# EasyEDA Pro project 20240709.epro

# Schematic B1

## Sheets
1 ETH: Board Name: Project; Create Date: 2024-09-07; Page Name: ETH; Project Name: 20240907; Schematic Name: B1; Update Date: 2024-09-07
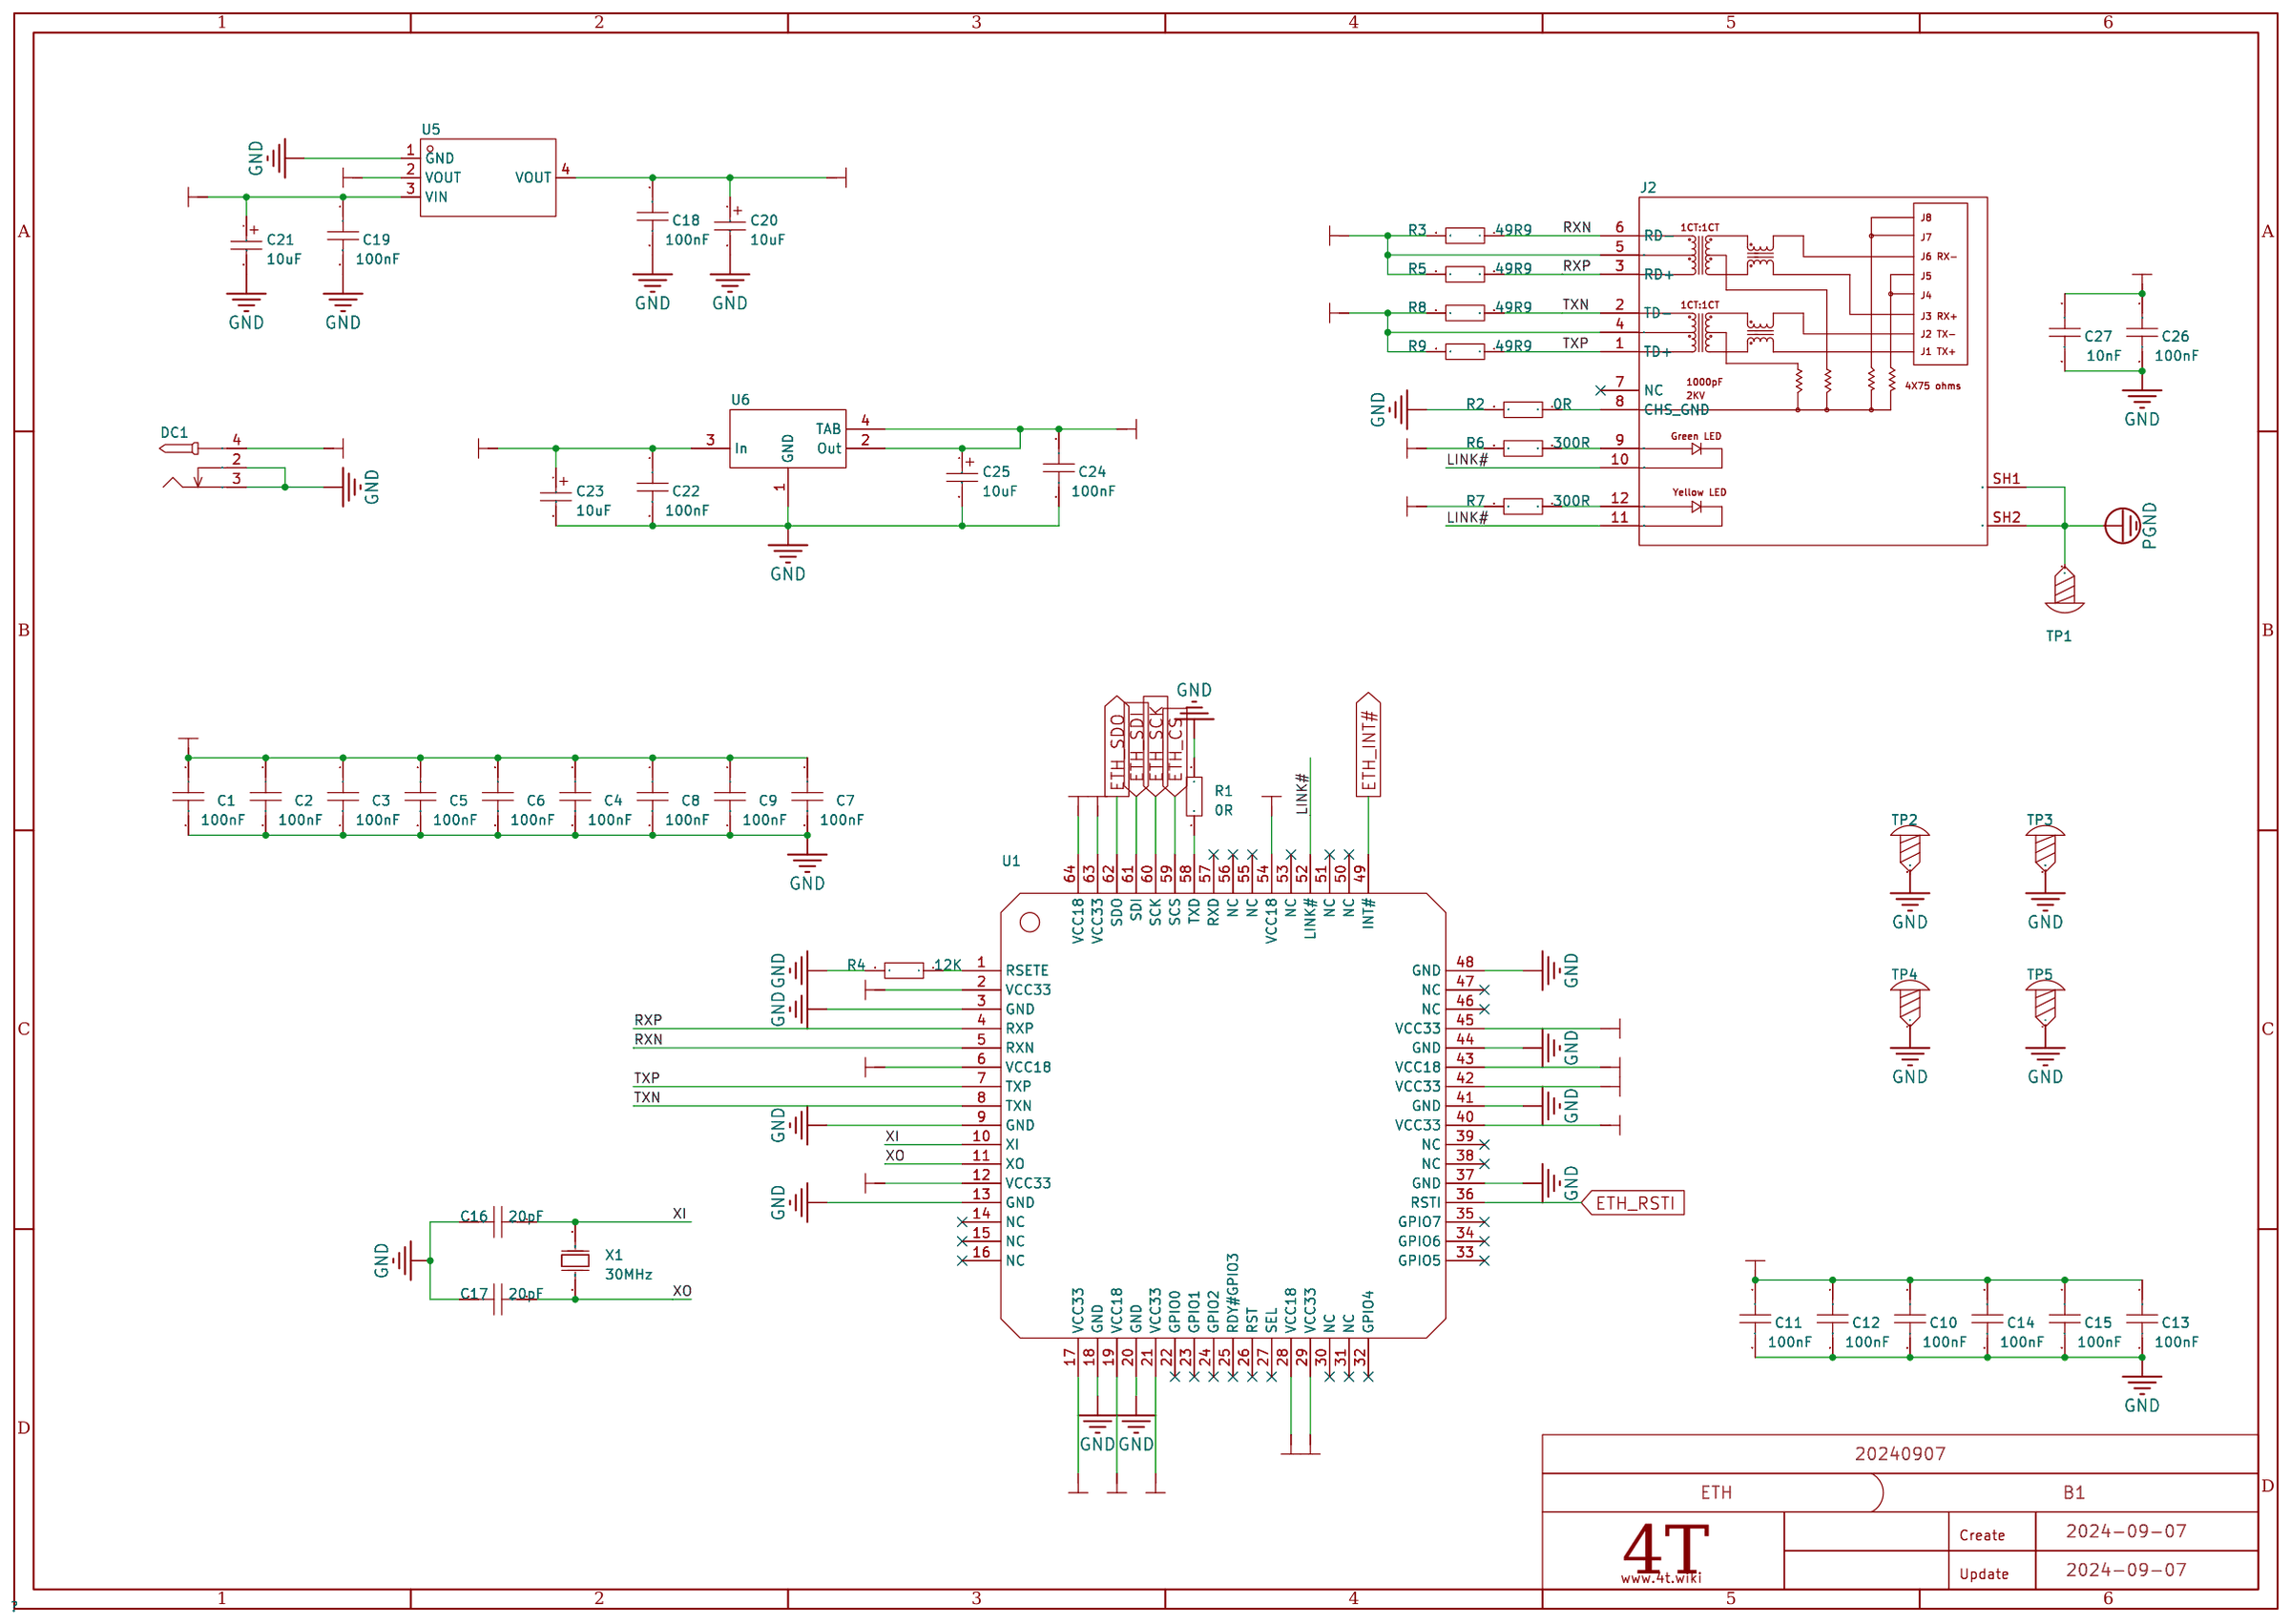
[diagram p0: ETH]
2 MP: Page Name: MP
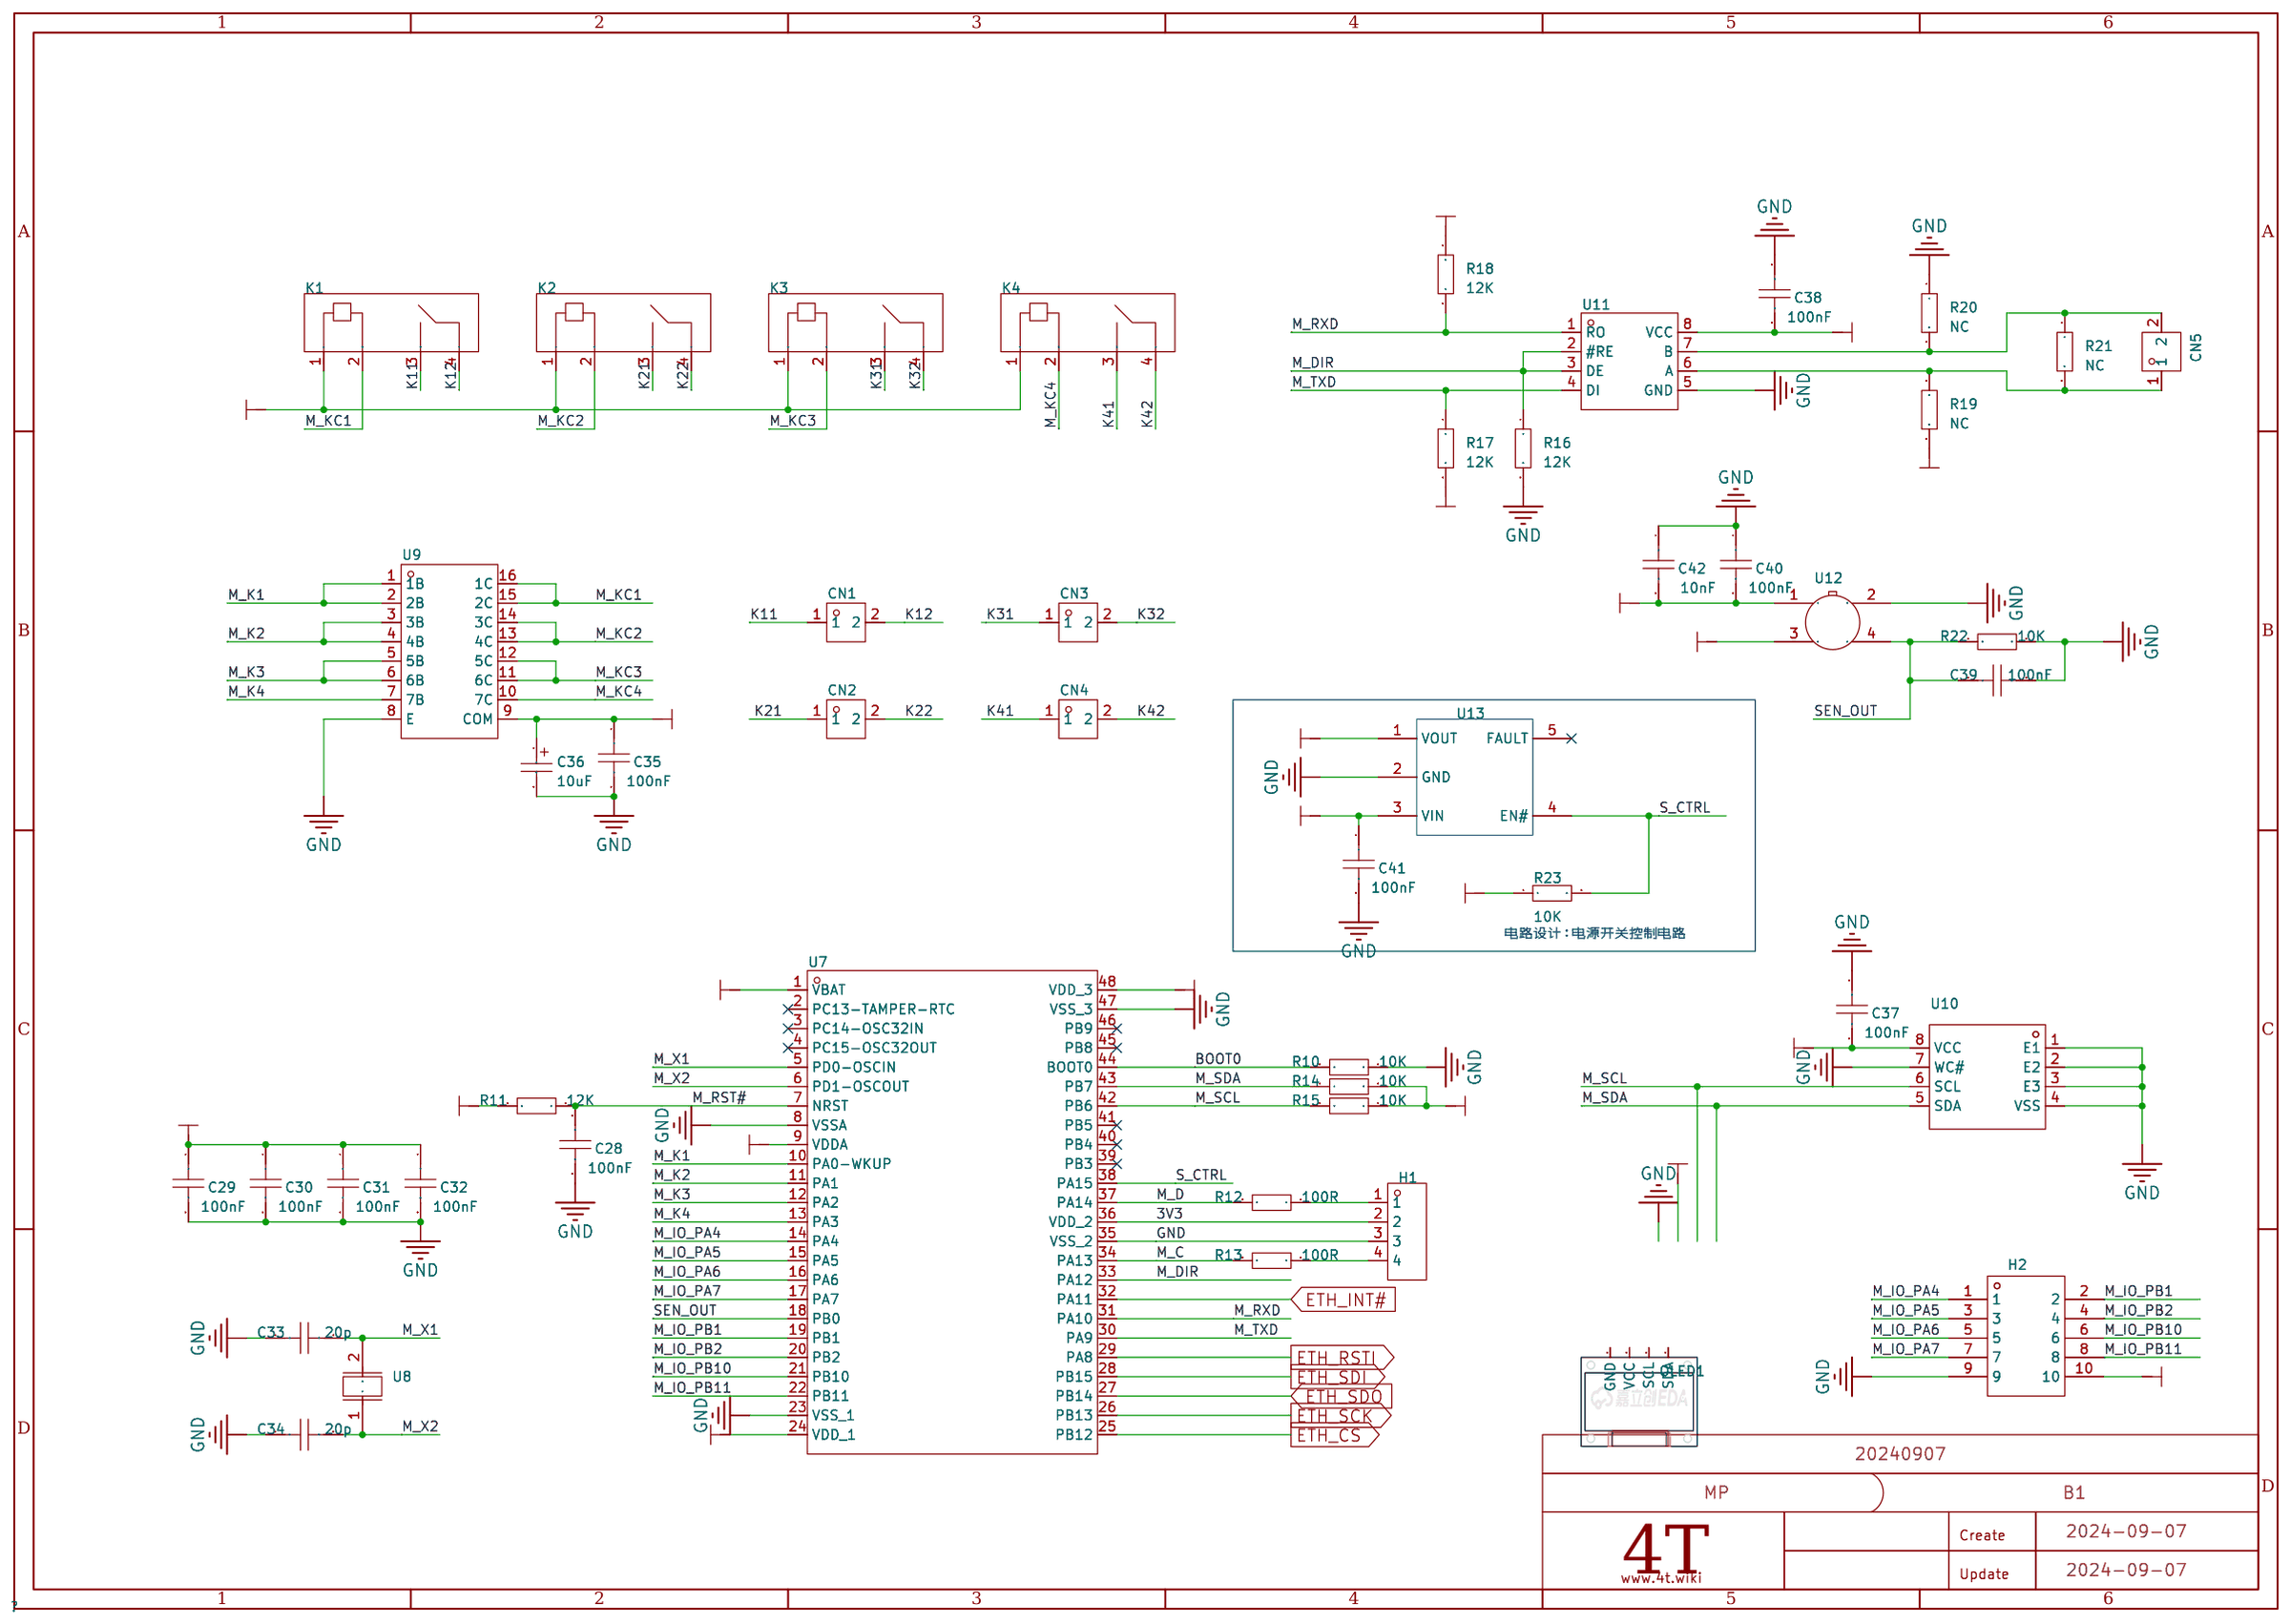
[diagram p1: MP]

## Parts
sheet ETH
C1  100nF  [C0805]
C2  100nF  [C0805]
C3  100nF  [C0805]
C4  100nF  [C0805]
C5  100nF  [C0805]
C6  100nF  [C0805]
C7  100nF  [C0805]
C8  100nF  [C0805]
C9  100nF  [C0805]
C10  100nF  [C0805]
C11  100nF  [C0805]
C12  100nF  [C0805]
C13  100nF  [C0805]
C14  100nF  [C0805]
C15  100nF  [C0805]
C16  20pF  [C0805]
C17  20pF  [C0805]
C18  100nF  [C0805]
C19  100nF  [C0805]
C20  10uF  [C_Ele_SMD_3x5.4mm]
C21  10uF  [C_Ele_SMD_3x5.4mm]
C22  100nF  [C0805]
C23  10uF  [C_Ele_SMD_3x5.4mm]
C24  100nF  [C0805]
C25  10uF  [C_Ele_SMD_3x5.4mm]
C26  100nF  [C0805]
C27  10nF  [C0805]
DC1  -  [DC-2.0]
J2  HY911105AE  [RJ45-TH_HR911105A]
R1  0R  [R0805]
R2  0R  [R0805]
R3  49R9  [R0805]
R4  12K  [R0805]
R5  49R9  [R0805]
R6  300R  [R0805]
R7  300R  [R0805]
R8  49R9  [R0805]
R9  49R9  [R0805]
TP1  -  [M3螺丝]
TP2  -  [M2螺丝]
TP3  -  [M2螺丝]
TP4  -  [M2螺丝]
TP5  -  [M2螺丝]
U1  CH395Q  [LQFP-64_L10.0-W10.0-P0.50-LS12.0-BL]
U5  AMS1117-3.3  [SOT-223-3_L6.5-W3.4-P2.30-LS7.0-BR]
U6  AMS1117-1.8  [SOT-223-4_L6.5-W3.5-P2.30-LS7.0-BR]
X1  30MHz  [OSC-SMD_L5.0-W3.2]
sheet MP
C28  100nF  [C0805]
C29  100nF  [C0805]
C30  100nF  [C0805]
C31  100nF  [C0805]
C32  100nF  [C0805]
C33  20p  [C0805]
C34  20p  [C0805]
C35  100nF  [C0805]
C36  10uF  [C_Ele_SMD_3x5.4mm]
C37  100nF  [C0805]
C38  100nF  [C0805]
C39  100nF  [C0805]
C40  100nF  [C0805]
C41  100nF  [C0805]
C42  10nF  [C0805]
CN1  KF128L-5.08-2P 蓝色  [TH_KF128L-5.08-2P]
CN2  KF128L-5.08-2P 蓝色  [TH_KF128L-5.08-2P]
CN3  KF128L-5.08-2P 蓝色  [TH_KF128L-5.08-2P]
CN4  KF128L-5.08-2P 蓝色  [TH_KF128L-5.08-2P]
CN5  KF128L-5.08-2P 蓝色  [TH_KF128L-5.08-2P]
H1  -  [HDR-TH_4P-P2.54-V-F]
H2  -  [HDR-TH_10P-P2.54-V-M-R2-C5-S2.54]
K1  HF49FD/012-1H12  [RELAY-TH_HF49FD-XXX-1H12-XXX]
K2  HF49FD/012-1H12  [RELAY-TH_HF49FD-XXX-1H12-XXX]
K3  HF49FD/012-1H12  [RELAY-TH_HF49FD-XXX-1H12-XXX]
K4  HF49FD/012-1H12  [RELAY-TH_HF49FD-XXX-1H12-XXX]
OLED1  -  [0.96OLED_4P]
R10  10K  [R0805]
R11  12K  [R0805]
R12  100R  [R0805]
R13  100R  [R0805]
R14  10K  [R0805]
R15  10K  [R0805]
R16  12K  [R0805]
R17  12K  [R0805]
R18  12K  [R0805]
R19  NC  [R0805]
R20  NC  [R0805]
R21  NC  [R0805]
R22  10K  [R0805]
R23  10K  [R0805]
U7  GD32F303CBT6  [LQFP-48_L7.0-W7.0-P0.50-LS9.0-BL]
U8  8M-5032-2P  [CRYSTAL-SMD_L5.0-W3.2]
U9  ULN2003  [SOIC-16_L9.9-W3.9-P1.27-LS6.0-BL]
U10  M24C02-WMN6TP  [SOIC-8_L4.9-W3.9-P1.27-LS6.0-BL]
U11  MAX3485ESA  [SOP-8_L5.0-W4.0-P1.27-LS6.0-BL]
U12  MP-2  [SENSOR-TH_MP-5]
U13  -  [SOT_PDS]

## Library data of the parts
C1-C19 C22 C24 C26-C35 C37-C42 = CAP_0603: Supplier Footprint: 0603
C20 C21 C23 C25 C36 = C_Ele_SMD_3x5.4mm: Supplier Footprint: SMD,3x5.4mm
DC1 = DC-005_2.0: Supplier Footprint: 插件
J2 = HY911105AE: 连接器类型:RJ插座;USOC代码:RJ45;端口数量:1;等级:-;屏蔽:-;LED:-;; LCSC Part Name: RJ45 带变压器; Supplier Part: C69427; Manufacturer: HANRUN(汉仁); Supplier Footprint: 插件; JLCPCB Part Class: 扩展库; Datasheet: https://atta.szlcsc.com/upload/public/pdf/source/20160507/1462613611469.pdf; Supplier: LCSC; Connector Type: RJ插座; USOC Codes: RJ45; Number of Ports: 1
R1-R23 = Res_0805: Supplier Footprint: 0805
TP1 = M3螺丝: Supplier Footprint: 插件
TP2-TP5 = M2螺丝: Supplier Footprint: 插件
U1 = CH395Q: 应用功能:以太网控制器;通道数:-;接口类型:Parallel, SPI, UART;电源电压:1.65V~3.6V;电源电流:90mA;; Supplier Part: C87390; Manufacturer: WCH(南京沁恒); Supplier Footprint: LQFP-64(10x10); JLCPCB Part Class: 扩展库; Datasheet: https://atta.szlcsc.com/upload/public/pdf/source/20200903/C87390_2BA27438C515B4B897A780BE99160E01.pdf; Supplier: LCSC; Application Function: 以太网控制器; Interface: Parallel, SPI, UART; Supply Voltage: 1.65V~3.6V; Supply Current: 90mA
U5 = AMS1117-3.3_C6186: 输出类型:固定;输出极性:正;输出通道数:1;最大输入电压:-;输出电压:3.3V;压差:1.3V@(800mA);静态电流(地电流):-;输出电流:1A;电源纹波抑制比(PSRR):72dB@(120Hz);噪声:-;特性:-;工作温度:-;; LCSC Part Name: 正 Vout=3.3V 1A 72dB@(120Hz); Supplier Part: C6186; Manufacturer: AMS; Supplier Footprint: SOT-223-3; JLCPCB Part Class: 基础库; Datasheet: https://atta.szlcsc.com/upload/public/pdf/source/20180727/C6186_7A095716F0823C02F1997A905E26C086.pdf; Supplier: LCSC; Output Type: 固定; Output Polarity: 正; Number of Outputs: 1; Output Voltage: 3.3V; Dropout Voltage: 1.3V@(800mA); Output Current: 1A; Power Supply Rejection Ratio (PSRR): 72dB@(120Hz)
U6 = AMS1117-1.8_C6185: 输出类型:固定;输出极性:正;输出通道数:1;最大输入电压:15V;输出电压:1.8V~1.8V;压差:1.3V@(1A);输出电流:1A;电源纹波抑制比(PSRR):75dB@(120Hz);; LCSC Part Name: 正 Vin=15V Vout=1.8V~1.8V 1A 75dB@(120Hz); Supplier Part: C6185; Manufacturer: AMS; Supplier Footprint: SOT-223-4; JLCPCB Part Class: 扩展库; Datasheet: https://atta.szlcsc.com/upload/public/pdf/source/20180727/C6186_7A095716F0823C02F1997A905E26C086.pdf; Supplier: LCSC; Output Type: 固定; Output Polarity: 正; Number of Outputs: 1; Maximum Input Voltage: 15V; Output Voltage: 1.8V~1.8V; Dropout Voltage: 1.3V@(1A); Output Current: 1A; Power Supply Rejection Ratio (PSRR): 75dB@(120Hz)
X1 = X503230MSB2GI: 晶振类型:贴片无源晶振;频率:30MHz;频率公差:±10ppm;频率稳定度:±50ppm;负载电容:20pF;工作温度:-40℃~+85℃;; LCSC Part Name: YSX530GA 30MHz ±10ppm 20pF; Supplier Part: C112563; Manufacturer: YXC(扬兴晶振); Supplier Footprint: SMD5032-2P; JLCPCB Part Class: 扩展库; Datasheet: https://atta.szlcsc.com/upload/public/pdf/source/20210329/C112559_847D3CACBA33ACCEB57DEA3AEBB187A1.pdf; Supplier: LCSC; Crystal Type: 贴片无源晶振; Frequency Tolerance: ±10ppm; Frequency Stability: ±50ppm; Load Capacitance: 20pF; Operating Temperature: -40℃~+85℃
CN1-CN5 = KF128L-5.08-2P 蓝色: Supplier Part: C2916931; Supplier Footprint: 5.08-2P; JLCPCB Part Class: 扩展库; Supplier: LCSC
H1 = HDR-F_2.54_1x4P: Supplier Part: C2718488; Supplier Footprint: 插件
H2 = HDR-M_2.54_2x5: Supplier Part: C124387; Supplier Footprint: 插件,P=2.54mm
K1-K4 = HF49FD/012-1H12: 线圈电压:12V;线圈类型:非极化-单线圈;触点形式:一组常开:1A(单刀单掷-常开);最大切换电流:5A;触点材料:AgNi;; LCSC Part Name: 宏发继电器; Supplier Part: C399491; Manufacturer: HF(宏发); Supplier Footprint: SIP-4; JLCPCB Part Class: 扩展库; Datasheet: https://atta.szlcsc.com/upload/public/pdf/source/20190620/C399491_B2190B02DDD565265172868420E7880D.pdf; Supplier: LCSC; Coil Voltage: 12V; Coil Type: 非极化-单线圈; Pin Number: 4; Contact Form: 一组常开:1A(单刀单掷-常开); Maximum Switching Current: 5A; Maximum Switching Voltage: 250V@AC；30V@DC; Coil Rated Power: 120mW; Contact Rating: 5A@30VDC；5A@250VAC; Coil Resistance: 1.2kΩ; Operate Time: 10ms; Release Time: 5ms; Contact Resistance: 100mΩ; Contact Material: AgNi; Operating Temperature: -40℃~+85℃
OLED1 = 0.96OLED模块_4P: Supplier Footprint: 插件
U7 = GD32F303CBT6_C3013779: CPU内核:ARM Cortex-M4;CPU最大主频:120MHz;工作电压范围:-;程序存储容量:128KB;RAM总容量:32KB;EEPROM/数据 FLASH容量:128KB;GPIO端口数量:37;ADC(位数):12bit;DAC(位数):12bit;(E)PWM(位数):-;8位Timer数量:-;16位Timer数量:7;32位Timer数量:-;CAN路数:1;U(S)ART路数:3;I2C路数:2;I2S路数:2;(Q)SPI路数:3;外设/功能:看门狗；RTC实时时钟;内部振荡器:; LCSC Part Name: ARM Cortex-M4 120MHz; Supplier Part: C3013779; Manufacturer: GigaDevice(兆易创新); Supplier Footprint: LQFP-48(7x7); JLCPCB Part Class: 扩展库; Datasheet: https://atta.szlcsc.com/upload/public/pdf/source/20220624/E1A57ED816B162D6D1424864911A792F.pdf; Supplier: LCSC; CPU Core: ARM Cortex-M4; CPU Maximum Speed: 120MHz; Program Storage Size: 128KB; Program Memory Type: FLASH; RAM Size: 32KB; EEPROM: 128KB; GPIO Ports Number: 37; ADC (Bit): 12bit; DAC (Bit): 12bit; 16Bit Timer: 7; CAN: 1; UART/USART: 3; I2C: 2; I2S: 2; SPI: 3; Peripheral/Function: 看门狗；RTC实时时钟; Watchdog: 有; Real-Time Clock: 有
U8 = 8M-5032-2P: Supplier Part: C9900017580; Supplier Footprint: 8MHz; JLCPCB Part Class: 扩展库; Supplier: LCSC
U9 = ULN2003: 开态输入电压(VI(on)@Vce,Ic):3V@2V,300mA;集射极饱和压降(VCE(sat)@Ii,Ic):1.2V@500uA,350mA;输出漏电流(Icex@Vce):50uA@50V;开态输入电流(Ii@Vi):-;关态输入电流(Ii(off)@Vce,Ic):65uA@50V,500uA;嵌位二极管漏电流(IR@VR):50uA@50V;嵌位二极管正向压降(VF@IF):1.7V@350mA;输入电容(Ci):15pF;工作温度:-20℃~+85℃;; Supplier Part: C688859; Manufacturer: IDCHIP(英锐芯); Supplier Footprint: SOIC-16; JLCPCB Part Class: 扩展库; Datasheet: https://atta.szlcsc.com/upload/public/pdf/source/20210302/C688859_5C67C6CBB0EA78EF92AFC966B53E1AD0.pdf; Supplier: LCSC; ON-state input   voltage(VI(on)@Vce,Ic): 3V@2V,300mA; Collector-emitter   saturation voltage (VCE(sat)@Ii,Ic): 1.2V@500uA,350mA; Output leakage current (Icex@Vce): 50uA@50V; Off-state input current (Ii(off)@Vce,Ic): 65uA@50V,500uA; Clamp Diode Leakage Current (IR@VR): 50uA@50V; Clamp Diode Forward Voltage (VF@IF): 1.7V@350mA; Input Capacitance (Ci): 15pF; Operating Temperature: -20℃~+85℃
U10 = M24C02-WMN6TP: 2-Kbit(256 x 8bit)，I2C接口，工作电压：2.5V to 5.5V; Supplier Part: C7562; Manufacturer: ST(意法半导体); Supplier Footprint: SOIC-8; JLCPCB Part Class: 基础库; Datasheet: https://atta.szlcsc.com/upload/public/pdf/source/20140724/1457707167301.pdf; Supplier: LCSC
U11 = MAX3485ESA: Supplier Part: C668204; Manufacturer: UMW(广东友台半导体); Supplier Footprint: SOP-8; JLCPCB Part Class: 扩展库; Datasheet: https://atta.szlcsc.com/upload/public/pdf/source/20221009/BC018EFD0F414E24649E284F574E449C.pdf; Supplier: LCSC
U12 = MP-2: Supplier Part: C242497; Manufacturer: Winsen(炜盛); Supplier Footprint: 插件; JLCPCB Part Class: 扩展库; Datasheet: https://atta.szlcsc.com/upload/public/pdf/source/20180704/C242497_B8D2418C2743DA3210851F2FB82DA8BD.pdf; Supplier: LCSC
U13 = PDS

## Nets
1V8: C10.1 C11.1 C12.1 C13.1 C14.1 C15.1 C24.1 C25.1 U1.6(VCC18) U1.19(VCC18) U1.28(VCC18) U1.43(VCC18) U1.54(VCC18) U1.63(VCC33) U6.2(Out) U6.4(TAB)
3V3: C1.1 C2.1 C3.1 C4.1 C5.1 C6.1 C7.1 C8.1 C9.1 C18.1 C20.1 C22.1 C23.1 C26.1 C27.1 C29.1 C30.1 C31.1 C32.1 C37.2 C38.2 H1.2 H2.10 J2.4 J2.5 R3.2 R5.2 R6.2 R7.2 R8.2 R9.2 R11.2 R14.2 R15.1 R17.2 R18.1 R19.2 R23.1 U1.2(VCC33) U1.12(VCC33) U1.17(VCC33) U1.21(VCC33) U1.29(VCC33) U1.40(VCC33) U1.42(VCC33) U1.45(VCC33) U1.64(VCC18) U5.2(VOUT) U5.4(VOUT) U6.3(In) U7.1(VBAT) U7.9(VDDA) U7.24(VDD_1) U7.36(VDD_2) U7.48(VDD_3) U10.8(VCC) U11.8(VCC) U12.3
GND: C1.2 C2.2 C3.2 C4.2 C5.2 C6.2 C7.2 C8.2 C9.2 C10.2 C11.2 C12.2 C13.2 C14.2 C15.2 C16.1 C17.1 C18.2 C19.2 C20.2 C21.2 C22.2 C23.2 C24.2 C25.2 C26.2 C27.2 C28.2 C29.2 C30.2 C31.2 C32.2 C33.1 C34.1 C35.2 C36.2 C37.1 C38.1 C39.2 C40.1 C41.2 C42.1 DC1.2 DC1.3 H1.3 H2.9 R1.2 R2.2 R4.2 R10.1 R16.2 R20.1 R22.2 TP2.1 TP3.1 TP4.1 TP5.1 U1.3(GND) U1.9(GND) U1.13(GND) U1.18(GND) U1.20(GND) U1.37(GND) U1.41(GND) U1.44(GND) U1.48(GND) U5.1(GND) U6.1(GND) U7.8(VSSA) U7.23(VSS_1) U7.35(VSS_2) U7.47(VSS_3) U9.8(E) U10.1(E1) U10.2(E2) U10.3(E3) U10.4(VSS) U10.7(WC#) U11.5(GND) U12.2 U13.2(GND)
PGND: J2.SH1 J2.SH2 TP1.1
BOOT0: R10.2 U7.44(BOOT0)
DC: C19.1 C21.1 C35.1 C36.1 C41.1 DC1.4 K1.1 K2.1 K3.1 K4.1 U5.3(VIN) U9.9(COM) U13.3(VIN)
ETH_CS: U1.59(SCS) U7.25(PB12)
ETH_INT#: U1.49(INT#) U7.32(PA11)
ETH_RSTI: U1.36(RSTI) U7.29(PA8)
ETH_SCK: U1.60(SCK) U7.26(PB13)
ETH_SDI: U1.61(SDI) U7.28(PB15)
ETH_SDO: U1.62(SDO) U7.27(PB14)
K11: CN1.1 K1.3
K12: CN1.2 K1.4
K21: CN2.1 K2.3
K22: CN2.2 K2.4
K31: CN3.1 K3.3
K32: CN3.2 K3.4
K41: CN4.1 K4.3
K42: CN4.2 K4.4
LINK#: J2.10 J2.11 U1.52(LINK#)
M_C: R13.2 U7.34(PA13)
M_D: R12.2 U7.37(PA14)
M_DIR: R16.1 U7.33(PA12) U11.2(#RE) U11.3(DE)
M_IO_PA4: H2.1 U7.14(PA4)
M_IO_PA5: H2.3 U7.15(PA5)
M_IO_PA6: H2.5 U7.16(PA6)
M_IO_PA7: H2.7 U7.17(PA7)
M_IO_PB1: H2.2 U7.19(PB1)
M_IO_PB2: H2.4 U7.20(PB2)
M_IO_PB10: H2.6 U7.21(PB10)
M_IO_PB11: H2.8 U7.22(PB11)
M_K1: U7.10(PA0-WKUP) U9.1(1B) U9.2(2B)
M_K2: U7.11(PA1) U9.3(3B) U9.4(4B)
M_K3: U7.12(PA2) U9.5(5B) U9.6(6B)
M_K4: U7.13(PA3) U9.7(7B)
M_KC1: K1.2 U9.15(2C) U9.16(1C)
M_KC2: K2.2 U9.13(4C) U9.14(3C)
M_KC3: K3.2 U9.11(6C) U9.12(5C)
M_KC4: K4.2 U9.10(7C)
M_RST#: C28.1 R11.1 U7.7(NRST)
M_RXD: R18.2 U7.31(PA10) U11.1(RO)
M_SCL: R15.2 U7.42(PB6) U10.6(SCL)
M_SDA: R14.1 U7.43(PB7) U10.5(SDA)
M_TXD: R17.1 U7.30(PA9) U11.4(DI)
M_X1: C33.2 U7.5(PD0-OSCIN) U8.2
M_X2: C34.2 U7.6(PD1-OSCOUT) U8.1
RXN: J2.6(RD-) R3.1 U1.5(RXN)
RXP: J2.3(RD+) R5.1 U1.4(RXP)
S_CTRL: R23.2 U7.38(PA15) U13.4(EN#)
SEN_OUT: C39.1 R22.1 U7.18(PB0) U12.4
TXN: J2.2(TD-) R8.1 U1.8(TXN)
TXP: J2.1(TD+) R9.1 U1.7(TXP)
V_HU: C40.2 C42.2 U12.1 U13.1(VOUT)
XI: C16.2 U1.10(XI) X1.2(OSC2)
XO: C17.2 U1.11(XO) X1.1(OSC1)
$1N6890: R4.1 U1.1(RSETE)
$1N7627: R1.1 U1.58(TXD)
$1N10654: J2.8(CHS GND) R2.1
$1N10919: J2.12 R7.1
$1N10952: J2.9 R6.1
$2N5291: H1.1 R12.1
$2N5344: H1.4 R13.1
$2N14954: CN5.2 R20.2 R21.1 U11.7(B)
$2N14989: CN5.1 R19.1 R21.2 U11.6(A)

Not connected (* = marked no-connect by the designer): J2 7(NC)*; OLED1 1(GND) 2(VCC) 3(SCL) 4(SDA); U1 14(NC)* 15(NC)* 16(NC)* 22(GPIO0)* 23(GPIO1)* 24(GPIO2)* 25(RDY#GPIO3)* 26(RST)* 27(SEL)* 30(NC)* 31(NC)* 32(GPIO4)* 33(GPIO5)* 34(GPIO6)* 35(GPIO7)* 38(NC)* 39(NC)* 46(NC)* 47(NC)* 50(NC)* 51(NC)* 53(NC)* 55(NC)* 56(NC)* 57(RXD)*; U7 2(PC13-TAMPER-RTC)* 3(PC14-OSC32IN)* 4(PC15-OSC32OUT)* 39(PB3)* 40(PB4)* 41(PB5)* 45(PB8)* 46(PB9)*; U13 5(FAULT)*

## Notes on the sheets
sheet 2
- 电路设计：电源开关控制电路

# Board B1
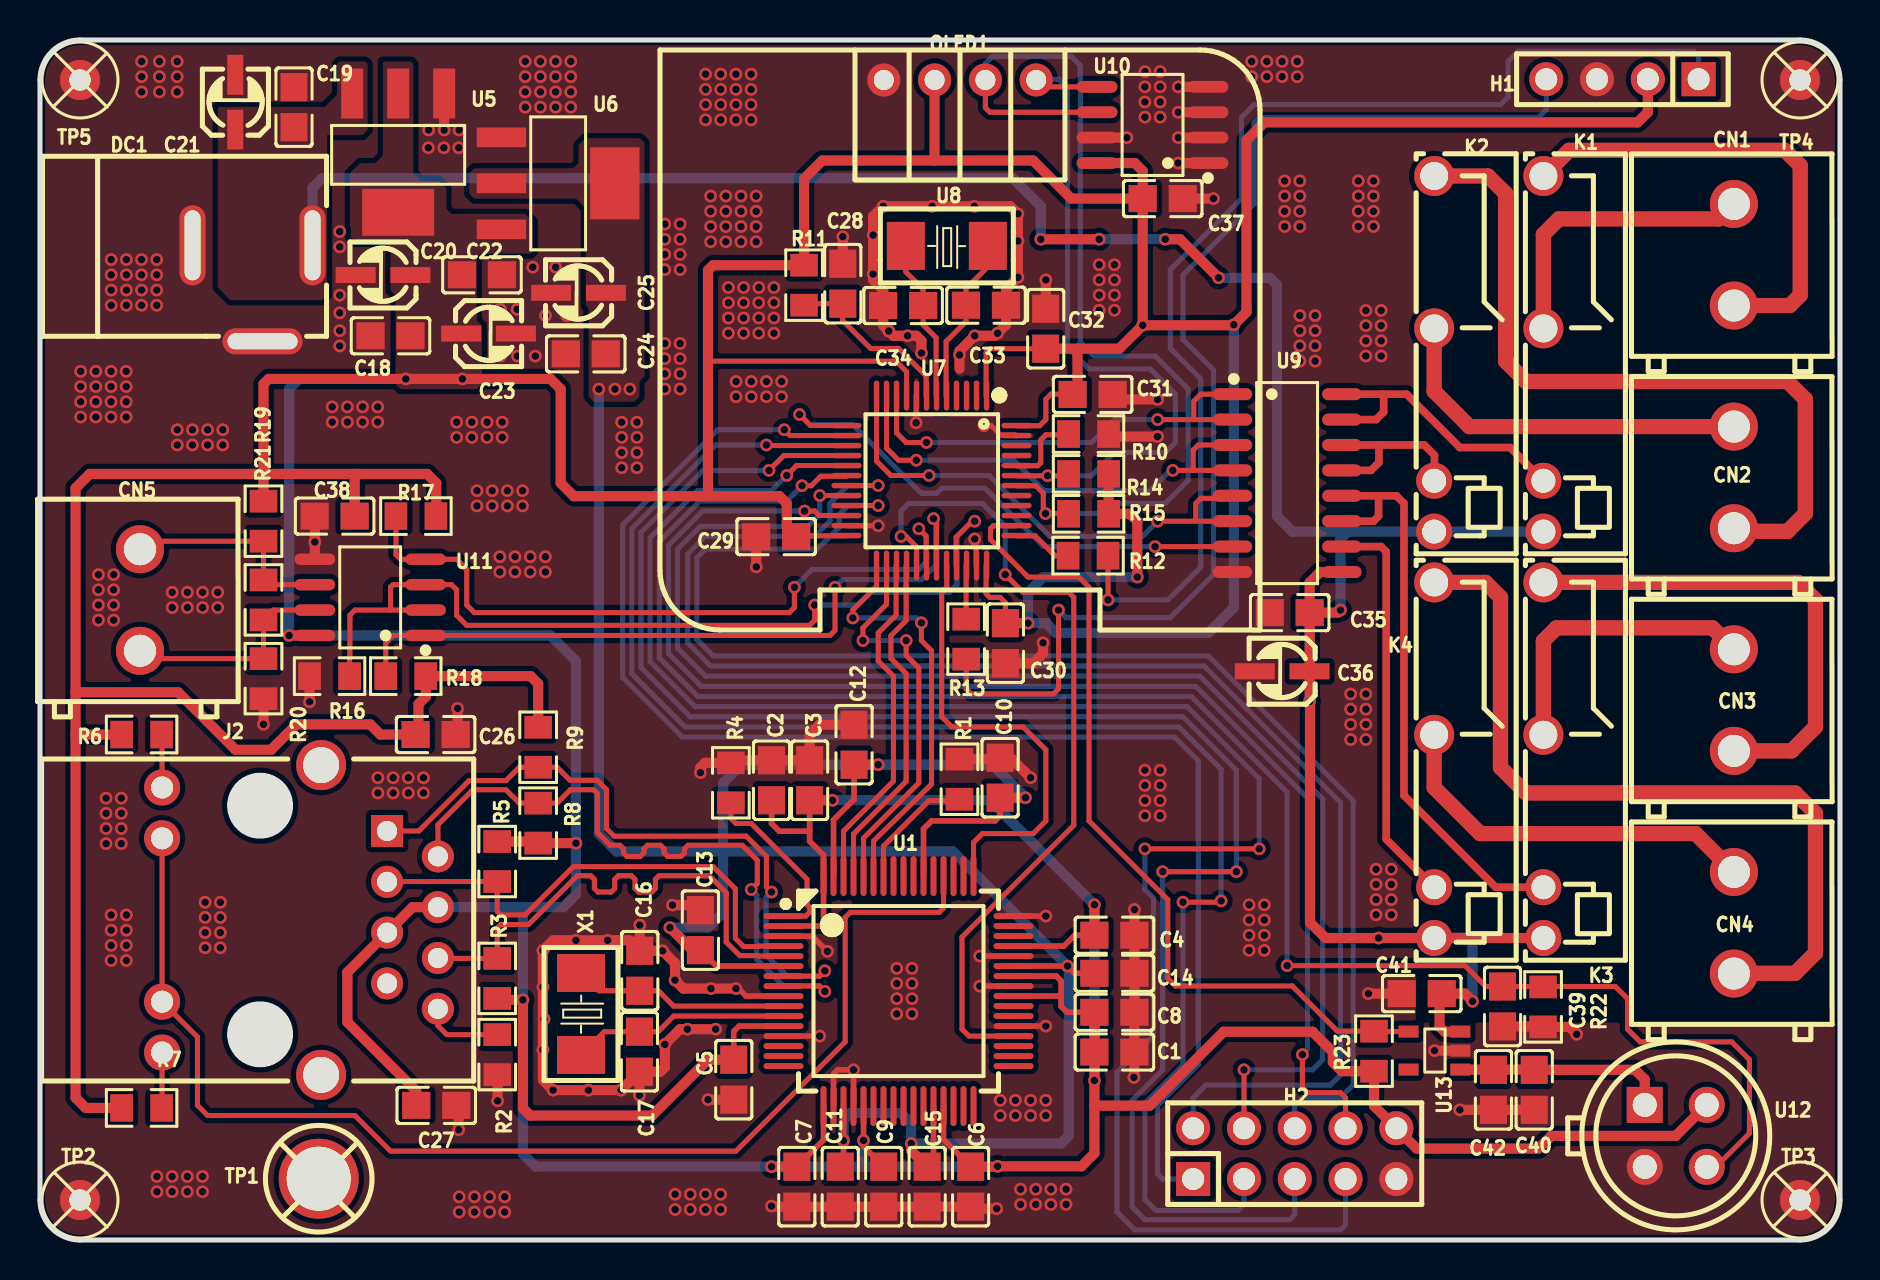
[diagram p2: board, top side]
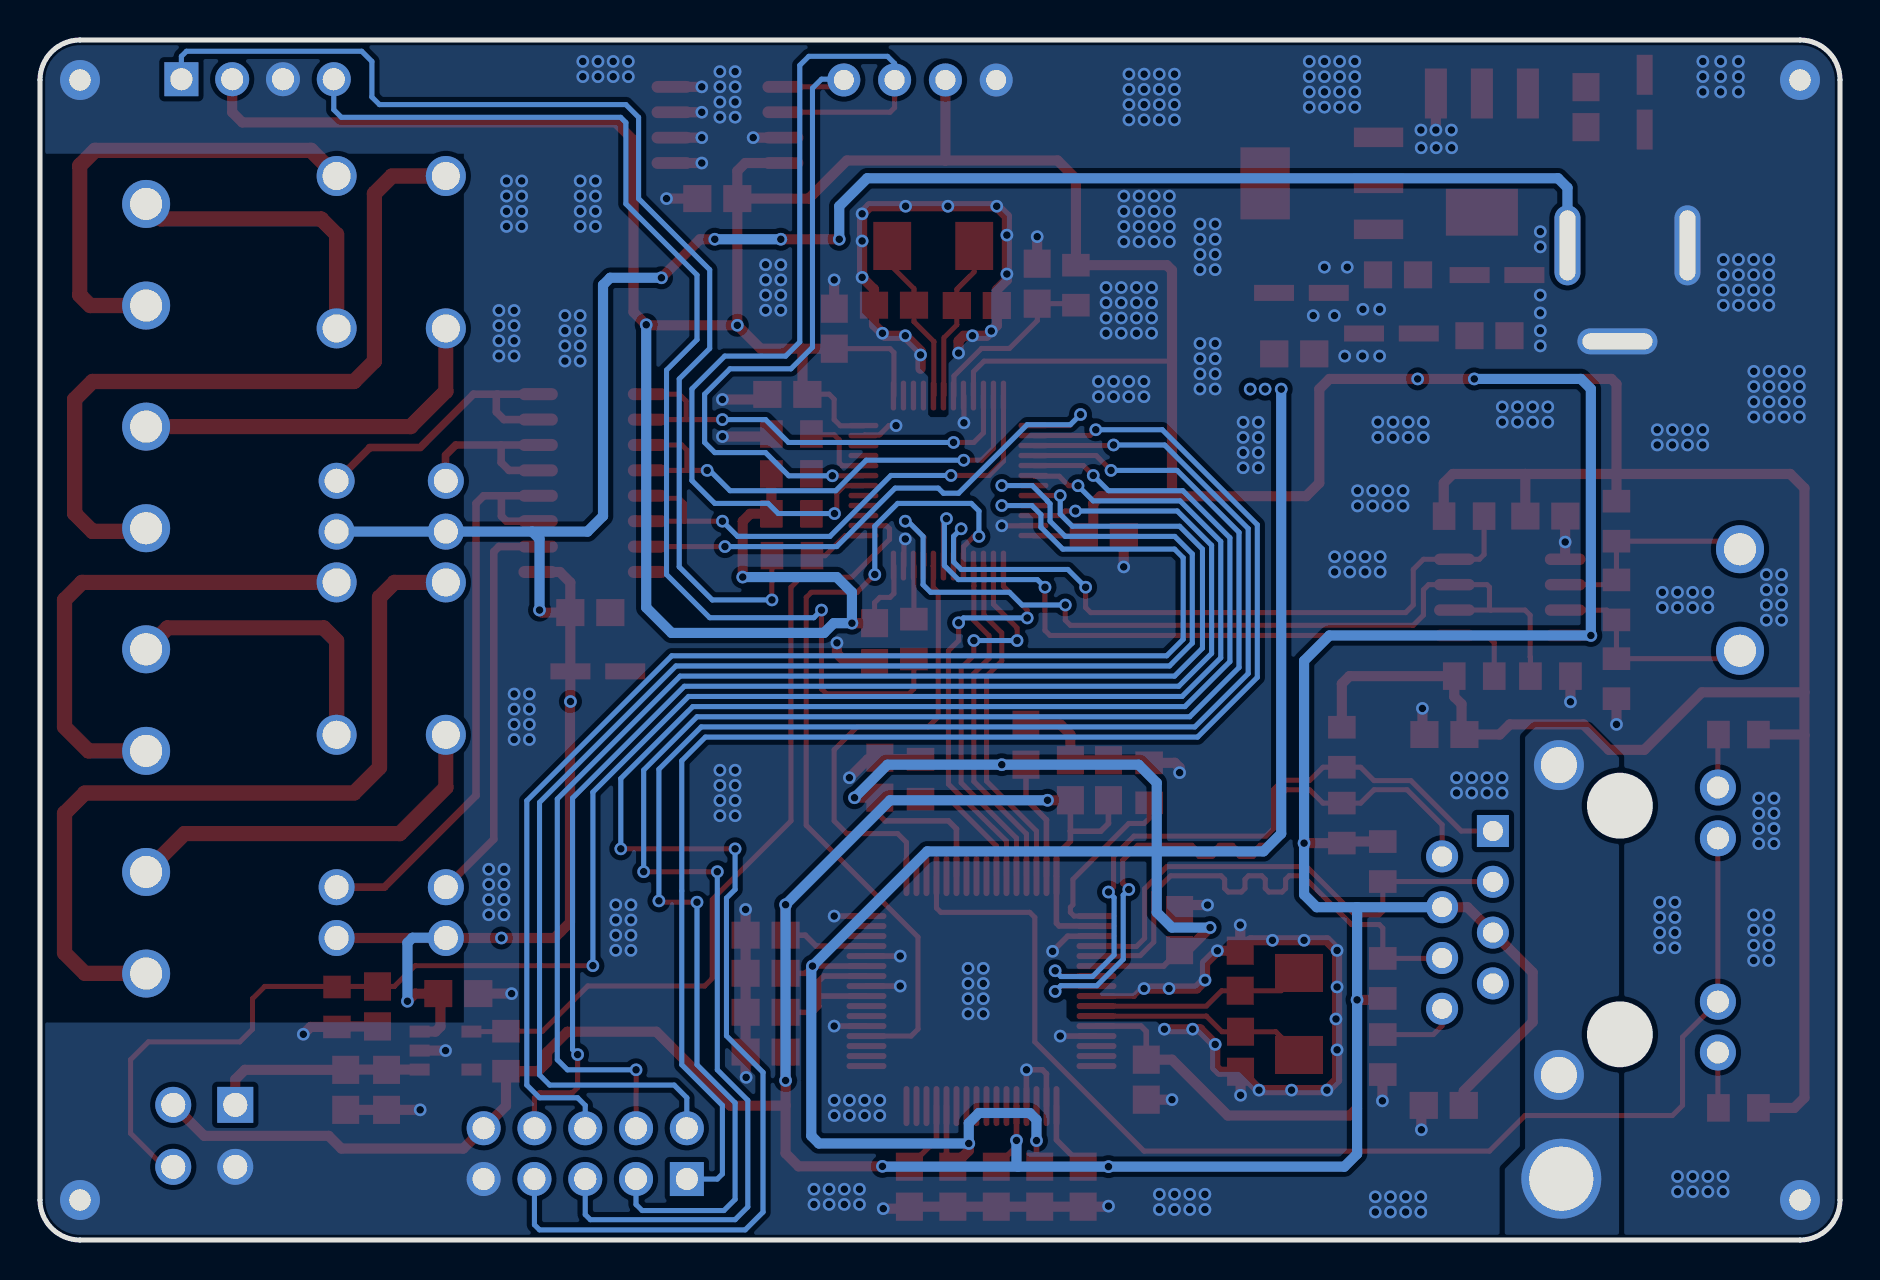
[diagram p3: board, bottom side, seen from below]

Outline 90 x 60 mm; copper layers: Top Layer, Bottom Layer. Coordinates in mm from the lower left corner of the outline.
Outline path: 0,58 0,2 arc(0.59,0.59) 2,0 88,0 arc(89.41,0.59) 90,2 90,58 arc(89.41,59.41) 88,60 2,60 arc(0.59,59.41) 0,58
Stack: Top Layer 0.035mm / Dielectric1 1.51mm FR4 er 4.5 / Bottom Layer 0.035mm

## Design rules (mm)
net 3V3: PWR
net GND: PWR
net 1V8: PWR
net DC: PWR
net V_HU: PWR
net TXP: TX_NP
net TXN: TX_NP
net RXP: RX_NP
net RXN: RX_NP
template: 用户自定义配置
spacing safeClearance (default): track to track 0.203, other pairs 0.152 to 0.203
track width trackWidth (default): min 0.254, default 0.254, max 2.54
track width PWR: min 0.254, default 0.508, max 2.54
differential pair differentialPair (default): width min 0.254, default 0.254, max 0.254; gap min 0.203, default 0.203
via viaSize (default): diameter min 0.635, default 0.635, max 0.635; hole min 0.381, default 0.381, max 0.381
net class PWR uses PWR
net 3V3 uses PWR
net GND uses PWR
net 1V8 uses PWR
net DC uses PWR
net V_HU uses PWR

## Placement (name value [footprint] x y rotation side)
C1  100nF  [C0805]  53.72 9.4 0 top
C2  100nF  [C0805]  36.58 22.99 90 top
C3  100nF  [C0805]  38.48 22.99 90 top
C4  100nF  [C0805]  53.72 15.24 0 top
C5  100nF  [C0805]  34.69 8.02 270 top
C6  100nF  [C0805]  46.53 2.67 270 top
C7  100nF  [C0805]  37.84 2.67 270 top
C8  100nF  [C0805]  53.72 11.38 0 top
C9  100nF  [C0805]  42.19 2.67 270 top
C10  100nF  [C0805]  48.01 23.11 90 top
C11  100nF  [C0805]  40.01 2.67 270 top
C12  100nF  [C0805]  40.7 24.77 90 top
C13  100nF  [C0805]  33.02 15.49 90 top
C14  100nF  [C0805]  53.72 13.33 0 top
C15  100nF  [C0805]  44.36 2.67 270 top
C16  20pF  [C0805]  29.99 13.46 270 top
C17  20pF  [C0805]  29.97 9.41 90 top
C18  100nF  [C0805]  17.53 45.21 180 top
C19  100nF  [C0805]  12.7 56.64 90 top
C20  10uF  [C_Ele_SMD_3x5.4mm]  17.14 48.26 0 top
C21  10uF  [C_Ele_SMD_3x5.4mm]  9.78 56.9 270 top
C22  100nF  [C0805]  22.1 48.26 0 top
C23  10uF  [C_Ele_SMD_3x5.4mm]  22.43 45.31 180 top
C24  100nF  [C0805]  27.29 44.31 180 top
C25  10uF  [C_Ele_SMD_3x5.4mm]  26.92 47.37 0 top
C26  100nF  [C0805]  19.78 25.27 0 top
C27  10nF  [C0805]  19.81 6.73 0 top
C28  100nF  [C0805]  40.14 47.82 90 top
C29  100nF  [C0805]  36.81 35.17 180 top
C30  100nF  [C0805]  48.27 29.84 270 top
C31  100nF  [C0805]  52.63 42.28 0 top
C32  100nF  [C0805]  50.28 45.57 90 top
C33  20p  [C0805]  47.3 46.74 180 top
C34  20p  [C0805]  43.16 46.72 0 top
C35  100nF  [C0805]  62.48 31.37 180 top
C36  10uF  [C_Ele_SMD_3x5.4mm]  62.1 28.45 0 top
C37  100nF  [C0805]  56.13 52.07 180 top
C38  100nF  [C0805]  14.73 36.19 0 top
C39  100nF  [C0805]  73.13 11.68 270 top
C40  100nF  [C0805]  74.71 7.51 90 top
C41  100nF  [C0805]  69.09 12.32 180 top
C42  10nF  [C0805]  72.67 7.51 90 top
CN1  KF128L-5.08-2P 蓝色  [TH_KF128L-5.08-2P]  84.69 49.26 270 top
CN2  KF128L-5.08-2P 蓝色  [TH_KF128L-5.08-2P]  84.69 38.13 270 top
CN3  KF128L-5.08-2P 蓝色  [TH_KF128L-5.08-2P]  84.69 27 270 top
CN4  KF128L-5.08-2P 蓝色  [TH_KF128L-5.08-2P]  84.69 15.86 270 top
CN5  KF128L-5.08-2P 蓝色  [TH_KF128L-5.08-2P]  5 32 270 top
DC1  -  [DC-2.0]  10.5 50 180 top
H1  -  [HDR-TH_4P-P2.54-V-F]  79.12 58.04 180 top
H2  -  [HDR-TH_10P-P2.54-V-M-R2-C5-S2.54]  62.74 4.32 0 top
J2  HY911105AE  [RJ45-TH_HR911105A]  13 16 270 top
K1  HF49FD/012-1H12  [RELAY-TH_HF49FD-XXX-1H12-XXX]  75.17 44.31 90 top
K2  HF49FD/012-1H12  [RELAY-TH_HF49FD-XXX-1H12-XXX]  69.71 44.31 90 top
K3  HF49FD/012-1H12  [RELAY-TH_HF49FD-XXX-1H12-XXX]  75.17 23.99 90 top
K4  HF49FD/012-1H12  [RELAY-TH_HF49FD-XXX-1H12-XXX]  69.71 23.99 90 top
OLED1  -  [0.96OLED_4P]  46 58 0 top
R1  0R  [R0805]  45.97 23.04 90 top
R2  0R  [R0805]  22.86 9.27 270 top
R3  49R9  [R0805]  22.86 13.08 270 top
R4  12K  [R0805]  34.54 22.86 90 top
R5  49R9  [R0805]  22.86 18.92 90 top
R6  300R  [R0805]  5.08 25.27 180 top
R7  300R  [R0805]  5.08 6.6 180 top
R8  49R9  [R0805]  24.91 20.84 270 top
R9  49R9  [R0805]  24.91 24.64 90 top
R10  10K  [R0805]  52.43 40.3 180 top
R11  12K  [R0805]  38.2 47.74 90 top
R12  100R  [R0805]  52.4 34.22 180 top
R13  100R  [R0805]  46.31 30.04 90 top
R14  10K  [R0805]  52.43 38.3 0 top
R15  10K  [R0805]  52.43 36.31 180 top
R16  12K  [R0805]  14.48 28.19 180 top
R17  12K  [R0805]  18.8 36.19 0 top
R18  12K  [R0805]  18.29 28.19 180 top
R19  NC  [R0805]  11.18 35.94 90 top
R20  NC  [R0805]  11.18 28.07 90 top
R21  NC  [R0805]  11.18 32 90 top
R22  10K  [R0805]  75.15 11.65 270 top
R23  10K  [R0805]  66.7 9.44 90 top
TP1  -  [M3螺丝]  14 3 0 top
TP2  -  [M2螺丝]  2 2 0 top
TP3  -  [M2螺丝]  88 2 0 top
TP4  -  [M2螺丝]  88 58 0 top
TP5  -  [M2螺丝]  2 58 0 top
U1  CH395Q  [LQFP-64_L10.0-W10.0-P0.50-LS12.0-BL]  42.93 12.45 270 top
U5  AMS1117-3.3  [SOT-223-3_L6.5-W3.4-P2.30-LS7.0-BR]  17.91 54.36 90 top
U6  AMS1117-1.8  [SOT-223-4_L6.5-W3.5-P2.30-LS7.0-BR]  25.91 52.83 180 top
U7  GD32F303CBT6  [LQFP-48_L7.0-W7.0-P0.50-LS9.0-BL]  44.58 37.97 180 top
U8  8M-5032-2P  [CRYSTAL-SMD_L5.0-W3.2]  45.34 49.7 0 top
U9  ULN2003  [SOIC-16_L9.9-W3.9-P1.27-LS6.0-BL]  62.36 37.85 270 top
U10  M24C02-WMN6TP  [SOIC-8_L4.9-W3.9-P1.27-LS6.0-BL]  55.63 55.75 90 top
U11  MAX3485ESA  [SOP-8_L5.0-W4.0-P1.27-LS6.0-BL]  16.51 32.13 90 top
U12  MP-2  [SENSOR-TH_MP-5]  81.79 5.21 270 top
U13  -  [SOT_PDS]  71.02 8.52 90 top
X1  30MHz  [OSC-SMD_L5.0-W3.2]  27.05 11.3 90 top

## Footprints (pads in the part's own frame, mm; a bottom-side part is the same pattern mirrored in y, then rotated)
0.96OLED_4P
  round 1.65 hole 1: 1(-3.81,-0.002) 2(-1.27,0.002) 3(1.27,0.002) 4(3.81,0.002)
C0805
  rect 1.41x1.35 smd: 1(-1,0) 2(1,0)
C_Ele_SMD_3x5.4mm
  rect 1.999x0.8 smd: 1(1.374,-0.014) 2(-1.364,-0.014)
CRYSTAL-SMD_L5.0-W3.2
  rect 1.9x2.4 smd: 1(-2.05,0) 2(2.05,0)
DC-2.0
  oval 4x1.3 hole 3.5x0.8: 2(-0.627,5.067)
  oval 1.3x4 hole 0.8x3.5: 3(2.873,0.267) 4(-3.127,0.267)
HDR-TH_4P-P2.54-V-F
  rect 1.7x1.7 hole 1.1: 1(-3.81,0)
  round 1.7 hole 1.1: 2(-1.27,0) 3(1.27,0) 4(3.81,0)
HDR-TH_10P-P2.54-V-M-R2-C5-S2.54
  rect 1.7x1.7 hole 1.1: 1(-5.08,-1.27)
  round 1.7 hole 1.1: 2(-5.08,1.27) 3(-2.54,-1.27) 4(-2.54,1.27) 5(0,-1.27) 6(0,1.27) 7(2.54,-1.27) 8(2.54,1.27) 9(5.08,-1.27) 10(5.08,1.27)
LQFP-48_L7.0-W7.0-P0.50-LS9.0-BL
  oval 0.27x1.5 smd: 1(-2.75,-4.25) 2(-2.25,-4.25) 3(-1.75,-4.25) 4(-1.25,-4.25) 5(-0.75,-4.25) 6(-0.25,-4.25) 7(0.25,-4.25) 8(0.75,-4.25) 9(1.25,-4.25) 10(1.75,-4.25) 11(2.25,-4.25) 12(2.75,-4.25) 25(2.75,4.25) 26(2.25,4.25) 27(1.75,4.25) 28(1.25,4.25) 29(0.75,4.25) 30(0.25,4.25) 31(-0.25,4.25) 32(-0.75,4.25) 33(-1.25,4.25) 34(-1.75,4.25) 35(-2.25,4.25) 36(-2.75,4.25)
  oval 1.5x0.27 smd: 13(4.25,-2.75) 14(4.25,-2.25) 15(4.25,-1.75) 16(4.25,-1.25) 17(4.25,-0.75) 18(4.25,-0.25) 19(4.25,0.25) 20(4.25,0.75) 21(4.25,1.25) 22(4.25,1.75) 23(4.25,2.25) 24(4.25,2.75) 37(-4.25,2.75) 38(-4.25,2.25) 39(-4.25,1.75) 40(-4.25,1.25) 41(-4.25,0.75) 42(-4.25,0.25) 43(-4.25,-0.25) 44(-4.25,-0.75) 45(-4.25,-1.25) 46(-4.25,-1.75) 47(-4.25,-2.25) 48(-4.25,-2.75)
LQFP-64_L10.0-W10.0-P0.50-LS12.0-BL
  oval 0.3x2 smd: 1(-3.75,-5.75) 2(-3.25,-5.75) 3(-2.75,-5.75) 4(-2.25,-5.75) 5(-1.75,-5.75) 6(-1.25,-5.75) 7(-0.75,-5.75) 8(-0.25,-5.75) 9(0.25,-5.75) 10(0.75,-5.75) 11(1.25,-5.75) 12(1.75,-5.75) 13(2.25,-5.75) 14(2.75,-5.75) 15(3.25,-5.75) 16(3.75,-5.75) 33(3.75,5.75) 34(3.25,5.75) 35(2.75,5.75) 36(2.25,5.75) 37(1.75,5.75) 38(1.25,5.75) 39(0.75,5.75) 40(0.25,5.75) 41(-0.25,5.75) 42(-0.75,5.75) 43(-1.25,5.75) 44(-1.75,5.75) 45(-2.25,5.75) 46(-2.75,5.75) 47(-3.25,5.75) 48(-3.75,5.75)
  oval 2x0.3 smd: 17(5.75,-3.75) 18(5.75,-3.25) 19(5.75,-2.75) 20(5.75,-2.25) 21(5.75,-1.75) 22(5.75,-1.25) 23(5.75,-0.75) 24(5.75,-0.25) 25(5.75,0.25) 26(5.75,0.75) 27(5.75,1.25) 28(5.75,1.75) 29(5.75,2.25) 30(5.75,2.75) 31(5.75,3.25) 32(5.75,3.75) 49(-5.75,3.75) 50(-5.75,3.25) 51(-5.75,2.75) 52(-5.75,2.25) 53(-5.75,1.75) 54(-5.75,1.25) 55(-5.75,0.75) 56(-5.75,0.25) 57(-5.75,-0.25) 58(-5.75,-0.75) 59(-5.75,-1.25) 60(-5.75,-1.75) 61(-5.75,-2.25) 62(-5.75,-2.75) 63(-5.75,-3.25) 64(-5.75,-3.75)
M2螺丝
  round 2 hole 1.07: 1(0,0)
M3螺丝
  round 4 hole 3.2: 1(-0.064,0.064)
OSC-SMD_L5.0-W3.2
  rect 1.9x2.4 smd: 1(-2.05,0) 2(2.05,0)
R0805
  rect 1.133x1.377 smd: 1(-1,0) 2(1,0)
RELAY-TH_HF49FD-XXX-1H12-XXX
  round 1.8 hole 1.2: 1(-8.89,0) 2(-6.35,0)
  round 2 hole 1.4: 3(1.27,0) 4(8.89,0)
RJ45-TH_HR911105A
  rect 1.6x1.6 hole 1: 1(-4.45,4.355)
  round 1.6 hole 1: 2(-3.18,6.895) 3(-1.91,4.355) 4(-0.64,6.895) 5(0.63,4.355) 6(1.9,6.895) 7(3.17,4.355) 8(4.44,6.895)
  round 1.8 hole 1.1: 9(-6.625,-6.895) 10(-4.085,-6.895) 11(4.085,-6.895) 12(6.625,-6.895)
  round 2.5 hole 1.8: SH1(-7.745,1.055) SH2(7.745,1.055)
SENSOR-TH_MP-5
  rect 1.8x1.8 hole 1.2: 1(-1.549,-1.55)
  round 1.8 hole 1.2: 2(1.55,-1.55) 3(-1.55,1.55) 4(1.55,1.55)
SOIC-8_L4.9-W3.9-P1.27-LS6.0-BL
  oval 0.588x2.045 smd: 1(-1.905,-2.772) 2(-0.635,-2.772) 3(0.635,-2.772) 4(1.905,-2.772) 5(1.905,2.772) 6(0.635,2.772) 7(-0.635,2.772) 8(-1.905,2.772)
SOIC-16_L9.9-W3.9-P1.27-LS6.0-BL
  oval 0.602x1.971 smd: 1(-4.445,-2.736) 2(-3.175,-2.736) 3(-1.905,-2.736) 4(-0.635,-2.736) 5(0.635,-2.736) 6(1.905,-2.736) 7(3.175,-2.736) 8(4.445,-2.736) 9(4.445,2.736) 10(3.175,2.736) 11(1.905,2.736) 12(0.635,2.736) 13(-0.635,2.736) 14(-1.905,2.736) 15(-3.175,2.736) 16(-4.445,2.736)
SOP-8_L5.0-W4.0-P1.27-LS6.0-BL
  oval 0.574x2.035 smd: 1(-1.905,-2.768) 2(-0.635,-2.768) 3(0.635,-2.768) 4(1.905,-2.768) 5(1.905,2.768) 6(0.635,2.768) 7(-0.635,2.768) 8(-1.905,2.768)
SOT-223-3_L6.5-W3.4-P2.30-LS7.0-BR
  rect 2.5x1.1 smd: 1(2.97,-2.3) 2(2.97,0) 3(2.97,2.3)
  rect 2.34x3.6 smd: 4(-2.97,0)
SOT-223-4_L6.5-W3.5-P2.30-LS7.0-BR
  rect 2.47x0.98 smd: 1(2.835,-2.3) 2(2.835,0) 3(2.835,2.3)
  rect 2.47x3.6 smd: 4(-2.835,0)
SOT_PDS
  rect 0.6x1 smd: 1(0,0) 2(0.95,0) 3(1.9,0) 4(1.9,2.59) 5(0,2.59)
TH_KF128L-5.08-2P
  round 2.4 hole 1.6: 1(-2.54,0) 2(2.54,0)

## Nets
As in the schematic, except:
3V3: C1.1 C2.1 C3.1 C4.1 C5.1 C6.1 C7.1 C8.1 C9.1 C18.1 C20.1 C22.1 C23.1 C26.1 C27.1 C29.1 C30.1 C31.1 C32.1 C37.2 C38.2 H1.2 H2.10 J2.4 J2.5 OLED1.2 R3.2 R5.2 R6.2 R7.2 R8.2 R9.2 R11.2 R14.2 R15.1 R17.2 R18.1 R19.2 R23.1 U1.2 U1.12 U1.17 U1.21 U1.29 U1.40 U1.42 U1.45 U1.64 U5.2 U5.4 U6.3 U7.1 U7.9 U7.24 U7.36 U7.48 U10.8 U11.8 U12.3
GND: C1.2 C2.2 C3.2 C4.2 C5.2 C6.2 C7.2 C8.2 C9.2 C10.2 C11.2 C12.2 C13.2 C14.2 C15.2 C16.1 C17.1 C18.2 C19.2 C20.2 C21.2 C22.2 C23.2 C24.2 C25.2 C26.2 C27.2 C28.2 C29.2 C30.2 C31.2 C32.2 C33.1 C34.1 C35.2 C36.2 C37.1 C38.1 C39.2 C40.1 C41.2 C42.1 DC1.2 DC1.3 H1.3 H2.9 OLED1.1 R1.2 R2.2 R4.2 R10.1 R16.2 R20.1 R22.2 TP2.1 TP3.1 TP4.1 TP5.1 U1.3 U1.9 U1.13 U1.18 U1.20 U1.37 U1.41 U1.44 U1.48 U5.1 U6.1 U7.8 U7.23 U7.35 U7.47 U9.8 U10.1 U10.2 U10.3 U10.4 U10.7 U11.5 U12.2 U13.2
M_SCL: OLED1.3 R15.2 U7.42 U10.6
M_SDA: OLED1.4 R14.1 U7.43 U10.5

Pads without a net: J2 7; U1 14 15 16 22 23 24 25 26 27 30 31 32 33 34 35 38 39 46 47 50 51 53 55 56 57; U7 2 3 4 39 40 41 45 46; U13 5

## Via types
v1: diameter 0.635, hole 0.381, Top Layer to Bottom Layer, 533 vias

## Routing (per net, layer and track width the routed paths; a pad name or vN(x,y) marks a point on that pad's centre or on a via; arc(x,y) is an arc through that point)
1V8: length 130.6
  Top Layer w0.28: C12.1 40.7,22.03 39.68,21.01 U1.63 ; C15.1 44.68,3.98 U1.28 ; C13.1 33.82,13.7 U1.6 ; U1.43 v1(51.38,13.7) 51.74,13.33 C14.1 ; U1.19 v1(40.18,4.97) 40.18,3.83 C11.1 ; C10.1 48.01,21.21 47.75,20.95 44.58,20.95 44.18,20.55 U1.54
  Top Layer w0.508: C13.1 32.62,14.49 v1(31.5,15.62) ; C12.1 v1(41.91,23.77) ; C15.1 43.56,4.46 v1(43.56,4.83) ; C10.1 v1(49.28,22.11)
  Bottom Layer w0.508: 34.16,19.43 28.83,19.43 27.94,20.32 v1(27.94,42.55) ; 34.16,19.43 34.16,16.38 33.4,15.62 v1(31.5,15.62) ; 34.16,19.43 45.64,19.43 v1(51.38,13.7) 51.44,13.64 51.44,5.21 51.05,4.83 v1(43.56,4.83) 43.56,5.84 43.05,6.35 40.51,6.35 40.18,6.01 v1(40.18,4.97) ; 34.16,19.43 34.16,22.86 35.07,23.77 v1(41.91,23.77) 47.62,23.77 v1(49.28,22.11)
  vias: v1(28.75,42.55) v1(29.49,42.55)
3V3: length 534.5
  Top Layer w0.254: 49.96,44.57 47.5,44.57 47.3,44.37 47.3,42.21 ; 47.3,33.71 47.3,32.33 47.5,32.13 48.01,32.13 48.27,31.87 C30.1 ; U7.9 43.33,43.41 42.8,43.94 33.4,43.94 ; C29.1 37.85,35.21 40.3,35.21 ; 48.8,40.71 49.98,40.71 50.29,41.02 50.29,42.04 50.55,42.29 51.62,42.29 C31.1
  Top Layer w0.28: U1.45 51.19,14.7 51.74,15.24 C4.1 ; U1.2 37.18,15.7 39.04,15.7 39.18,15.84 U1.64 39.18,19.24 38.48,19.94 38.48,20.44 ; 51.05,12.14 51.05,12.95 50.81,13.2 U1.42 ; 51.05,12.14 51.05,11.68 51.35,11.38 C8.1 ; 51.05,12.14 50.99,12.2 U1.40 ; 38.48,20.44 36.96,20.44 36.58,20.83 C2.1 ; 38.48,20.44 C3.1 ; U1.21 41.18,4.68 C9.1 ; C6.1 45.18,5.02 U1.29 ; U1.12 34.95,10.7 34.69,10.43 C5.1 ; U1.17 39.18,5 C7.1
  Top Layer w0.508: 33.4,37.19 36.98,37.19 37.34,36.83 37.34,35.64 C29.1 ; 33.4,37.19 33.4,48.49 33.66,48.74 R11.2 38.2,53.06 39.12,53.97 44.73,53.97 ; 33.4,37.19 26.69,37.19 26.03,37.85 26.03,42.55 25.53,43.05 v1(21.12,43.05) v1(18.29,43.05) 11.43,43.05 11.18,42.8 11.18,38.3 ; 18.92,25.53 18.92,26.8 19.29,27.16 R18.1 24.53,28.19 24.91,27.81 R9.2 ; C37.2 55.13,53.45 54.74,53.85 U10.8 ; C37.2 51.56,52.07 49.66,53.97 44.73,53.97 ; C37.2 v1(55.13,45.74) ; 11.18,37.02 11.18,38.3 ; 11.18,38.3 2.49,38.3 1.78,37.59 1.78,27.39 ; 11.18,38.3 15.74,38.3 ; C27.1 18.81,7.45 15.37,10.89 15.37,13.38 J2.5 18.62,16.64 J2.4 ; C7.1 v1(36.58,3.67) ; 15.74,38.3 19.36,38.3 19.81,37.85 19.81,36.21 R17.2 ; 15.74,38.3 15.73,38.3 C38.2 ; R5.2 24.83,19.92 R8.2 v1(26.8,19.84) ; 1.78,27.39 6.9,27.39 9.78,24.51 11.56,24.51 12.83,25.78 16.51,25.78 17.02,25.27 C26.1 ; 1.78,27.39 1.78,25.23 ; v1(59.69,45.76) 60.32,46.4 60.32,54.99 61.21,55.88 79.88,55.88 80.39,56.39 H1.2 ; 22.86,12.01 v1(24.15,12.01) 24.15,6.59 24.51,6.22 30.61,6.22 33.4,9.02 C5.1 ; v1(55.13,45.74) 53.96,44.57 51.88,44.57 ; v1(55.13,45.74) 59.67,45.74 59.69,45.72 ; 44.73,53.97 44.73,58 OLED1.2 ; 1.78,25.23 1.82,25.27 R6.2 ; 1.78,25.23 1.78,7.11 2.29,6.6 R7.2 ; C3.1 v1(39.62,21.99) ; U12.3 81.79,5.21 75.56,5.21 74.93,4.57 68.83,4.57 H2.10 66.7,6.71 R23.1 65.09,8.44 64.64,8.89 64.64,9.4 63.63,10.41 59.18,10.41 55.49,6.72 52.72,6.72 ; v1(54.86,33.15) 54.86,35.94 54.49,36.31 R15.1 R14.2 ; 52.72,6.72 52.72,4.33 52.07,3.68 v1(47.88,3.68) 47.88,3.67 C6.1 ; 52.72,6.72 v1(52.72,7.97) C1.1 C8.1 ; 49.96,44.57 C32.1 51.88,44.57 ; U11.8 v1(12.46,30.23) ; 51.62,42.29 51.88,42.55 51.88,44.57 ; C4.1 v1(52.72,16.76) ; C30.1 v1(49.4,30.84)
  Bottom Layer w0.508: 24.15,16.64 26.17,16.64 26.8,17.27 v1(26.8,19.84) 26.8,28.96 25.53,30.23 v1(12.46,30.23) 12.46,42.56 12.95,43.05 v1(18.29,43.05) ; 24.15,16.64 v1(24.15,12.01) 24.15,4.3 24.78,3.67 v1(36.58,3.67) 41.1,3.67 ; 24.15,16.64 J2.4 ; v1(54.86,33.15) 50.16,33.15 49.4,32.39 v1(49.4,30.84) 50.31,30.84 50.8,30.35 58.42,30.35 59.69,31.62 v1(59.69,45.76) ; 41.1,3.67 41.18,3.75 v1(41.18,4.98) ; 41.1,3.67 47.86,3.67 v1(47.88,3.68) ; v1(39.62,21.99) 47.5,21.99 v1(52.72,16.76) v1(52.72,7.97)
GND: length 158.8
  Top Layer w0.254: 40.3,35.71 v1(41.91,35.71) ; 48.8,40.21 48.76,40.25 48.02,40.25 47.56,40.72 v1(47.2,40.72) ; v1(46.74,35.05) 46.8,34.98 46.8,33.71 ; 43.8,42.21 v1(43.8,40.86)
  Top Layer w0.28: U1.13 v1(38.99,10.2) ; U1.37 v1(50.29,10.7) ; v1(39.37,14.43) 38.62,15.19 37.18,15.19 U1.3 ; U1.44 v1(46.99,14.2) ; U1.41 v1(46.99,12.7) ; U1.9 35.3,12.2 34.95,12.55 34.93,12.52 ; U1.20 v1(40.68,8.51) 39.88,8.51 39.68,8.31 U1.18 ; U1.48 v1(50.29,16.2)
  Top Layer w0.508: C16.1 v1(29.99,15.75) ; C16.1 29.46,14.99 v1(28.38,14.99) v1(26.8,14.99) 25.65,14.99 v1(25.15,14.48) v1(25.15,12.65) v1(25.15,9.51) 25.15,8 v1(25.65,7.49) v1(27.42,7.49) v1(29.05,7.49) C17.1 ; C16.1 v1(31.13,14.46) 31.75,13.84 v1(31.75,12.99) 32.17,12.57 v1(33.55,12.57) v1(34.8,12.57) ; U10.4 v1(56.91,57.66) ; C37.1 v1(58.67,52.07) ; v1(55.88,42.03) 53.88,42.03 C31.2 ; v1(54.69,8.13) 54.72,8.16 C1.2 C8.2 C14.2 C4.2 v1(54.72,16.53) ; U10.1 v1(56.91,53.85) ; v1(36.57,1.69) 36.6,1.67 37.84,1.67 ; R20.1 v1(11.18,25.78) ; v1(70.99,6.51) C42.1 C40.1 ; C12.2 38.97,25.77 38.48,25.27 C3.2 C2.2 34.67,23.99 R4.2 33.26,23.86 33.02,23.62 v1(33.02,23.37) ; C5.2 v1(33.4,7.02) ; 20.93,6.8 v1(20.93,5.51) ; v1(49.53,23.11) 48.61,24.04 R1.2 ; U5.1 v1(20.21,55.5) ; v1(35.81,33.66) 35.81,35.16 C29.2 ; 53.5,40.3 53.63,40.17 v1(55.88,40.17) ; 46.55,1.57 v1(47.84,1.57) ; 33.4,16.24 32.89,16.75 v1(31.62,16.75) ; U11.5 v1(13.74,34.9) 13.74,36.19 C38.1 ; C28.2 v1(40.14,50.17) ; 20.88,25.29 v1(20.88,26.58) ; U10.7 v1(54.34,55.12) ; C7.2 C11.2 C9.2 C15.2 C6.2 ; U10.2 v1(56.91,55.12) ; v1(50.29,48.01) 50.29,46.57 C32.2 ; 45.97,43.56 v1(45.97,44.25) 45.97,44.45 v1(46.74,45.21) 47.75,45.21 v1(47.88,45.34) 48.3,45.76 C33.1 48.3,47.54 v1(48.9,48.13) v1(48.9,49.95) v1(48.9,51.31) 48.51,51.69 v1(46.72,51.69) v1(44.61,51.69) v1(42.16,51.69) 41.66,51.18 v1(41.66,50.25) 41.66,48.01 42.16,47.5 C34.1 42.16,45.73 v1(42.44,45.45) 42.67,45.21 v1(43.38,45.21) 43.81,45.21 44.07,44.96 v1(44.07,44.35) ; C30.2 49.67,28.84 50.15,29.32 v1(50.15,29.86) ; C17.1 31.02,8.41 31.24,8.64 v1(31.24,9.78) 32,10.54 v1(32.37,10.54) v1(33.78,10.54) ; C17.1 v1(29.97,7.24) ; R16.2 v1(13.48,26.91) ; U10.3 v1(56.91,56.39) ; U13.2 v1(69.72,9.47) ; C39.2 75.13,10.68 R22.2 76.47,10.65 v1(76.84,10.29) ; C41.2 v1(66.42,12.32) ; 22.88,8.24 v1(22.88,6.96)
  vias: v1(2.03,43.43) v1(2.03,42.67) v1(2.03,41.91) v1(2.03,41.15) v1(2.79,43.43) v1(2.79,42.67) v1(2.79,41.91) v1(2.79,41.15) v1(2.92,33.27) v1(2.92,32.51) v1(2.92,31.75) v1(2.92,30.99) v1(3.3,22.09) v1(3.3,21.33) v1(3.3,20.58) v1(3.3,19.82) v1(3.56,49.02) v1(3.56,48.26) v1(3.56,47.5) v1(3.56,46.74) v1(3.55,43.43) v1(3.55,42.67) v1(3.55,41.91) v1(3.55,41.15) v1(3.56,16.25) v1(3.56,15.49) v1(3.56,14.73) v1(3.56,13.97) v1(3.68,33.27) v1(3.68,32.51) v1(3.68,31.75) v1(3.68,30.99) v1(4.06,22.09) v1(4.06,21.33) v1(4.06,20.58) v1(4.06,19.82) v1(4.32,49.02) v1(4.32,48.26) v1(4.32,47.5) v1(4.32,46.74) v1(4.31,43.43) v1(4.31,42.67) v1(4.31,41.91) v1(4.31,41.15) v1(4.32,16.25) v1(4.32,15.49) v1(4.32,14.73) v1(4.32,13.97) v1(5.08,58.93) v1(5.08,58.17) v1(5.08,57.4) v1(5.08,49.02) v1(5.08,48.26) v1(5.08,47.5) v1(5.08,46.74) v1(5.84,49.02) v1(5.84,48.26) v1(5.84,47.5) v1(5.84,46.74) v1(5.85,3.18) v1(5.85,2.41) v1(5.97,58.93) v1(5.97,58.17) v1(5.97,57.4) v1(6.61,32.39) v1(6.61,31.62) v1(6.61,3.18) v1(6.61,2.41) v1(6.86,58.93) v1(6.86,58.17) v1(6.86,57.4) v1(6.86,40.51) v1(6.86,39.75) v1(7.37,32.39) v1(7.37,31.62) v1(7.36,3.18) v1(7.36,2.41) v1(7.62,40.51) v1(7.62,39.75) v1(8.13,32.39) v1(8.13,31.62) v1(8.12,3.18) v1(8.12,2.41) v1(8.25,16.89) v1(8.25,16.13) v1(8.25,15.37) v1(8.25,14.61) v1(8.38,40.51) v1(8.38,39.75) v1(8.89,32.39) v1(8.89,31.62) v1(9.02,16.89) v1(9.02,16.13) v1(9.02,15.37) v1(9.02,14.61) v1(9.14,40.51) v1(9.14,39.75) v1(14.61,41.66) v1(14.61,40.89) v1(14.99,50.42) v1(14.99,49.66) v1(14.99,47.24) v1(14.99,46.36) v1(14.99,45.47) v1(14.99,44.7) v1(15.37,41.66) v1(15.37,40.89) v1(16.13,41.66) v1(16.13,40.89) v1(16.89,41.66) v1(16.89,40.89) v1(16.9,23.11) v1(16.9,22.35) v1(17.65,23.11) v1(17.65,22.35) v1(18.41,23.11) v1(18.41,22.35) v1(19.17,23.11) v1(19.17,22.35) v1(19.43,55.5) v1(19.42,54.61) v1(20.19,54.61) v1(20.83,40.89) v1(20.83,40.13) v1(20.94,54.61) v1(20.95,55.5) v1(20.96,2.16) v1(20.96,1.4) v1(21.59,40.89) v1(21.59,40.13) v1(21.72,2.16) v1(21.72,1.4) v1(21.85,37.47) v1(21.85,36.7) v1(22.35,40.89) v1(22.35,40.13) v1(22.48,2.16) v1(22.48,1.4) v1(22.61,37.47) v1(22.61,36.7) v1(23.02,46.54) v1(23.02,44.2) v1(22.99,34.16) v1(22.99,33.4) v1(23.11,40.89) v1(23.11,40.13) v1(23.24,2.16) v1(23.24,1.4) v1(23.37,37.47) v1(23.37,36.7) v1(23.75,34.16) v1(23.75,33.4) v1(23.86,46.54) v1(23.88,44.2) v1(24.13,37.47) v1(24.13,36.7) v1(24.26,58.93) v1(24.26,58.17) v1(24.26,57.4) v1(24.26,56.64) v1(24.51,34.16) v1(24.51,33.4) v1(24.64,48.64) v1(24.77,44.2) v1(25.02,58.93) v1(25.02,58.17) v1(25.02,57.4) v1(25.02,56.64) v1(25.2,11.05) v1(25.28,46.22) v1(25.27,34.16) v1(25.27,33.4) v1(25.78,58.93) v1(25.78,58.17) v1(25.78,57.4) v1(25.78,56.64) v1(25.78,48.64) v1(26.34,46.22) v1(26.54,58.93) v1(26.54,58.17) v1(26.54,57.4) v1(26.54,56.64) v1(29.08,40.89) v1(29.08,40.13) v1(29.08,39.37) v1(29.08,38.61) v1(29.84,40.89) v1(29.84,40.13) v1(29.84,39.37) v1(29.84,38.61) v1(31.24,50.8) v1(31.24,50.04) v1(31.24,49.28) v1(31.24,48.52) v1(31.24,44.83) v1(31.24,44.07) v1(31.24,43.31) v1(31.24,42.55) v1(31.75,2.29) v1(31.75,1.52) v1(32,50.8) v1(32,50.04) v1(32,49.28) v1(32,48.52) v1(32,44.83) v1(32,44.07) v1(32,43.31) v1(32,42.55) v1(32.51,2.29) v1(32.51,1.52) v1(33.28,58.29) v1(33.28,57.53) v1(33.28,56.77) v1(33.28,56.01) v1(33.27,2.29) v1(33.27,1.52) v1(33.53,52.2) v1(33.53,51.44) v1(33.53,50.67) v1(33.53,49.91) v1(34.04,58.29) v1(34.04,57.53) v1(34.04,56.77) v1(34.04,56.01) v1(34.03,2.29) v1(34.03,1.52) v1(34.29,52.2) v1(34.29,51.44) v1(34.29,50.67) v1(34.29,49.91) v1(34.42,47.62) v1(34.42,46.86) v1(34.42,46.1) v1(34.42,45.34) v1(34.79,58.29) v1(34.79,57.53) v1(34.79,56.77) v1(34.79,56.01) v1(34.8,42.93) v1(34.8,42.16) v1(35.05,52.2) v1(35.05,51.44) v1(35.05,50.67) v1(35.05,49.91) v1(35.18,47.62) v1(35.18,46.86) v1(35.18,46.1) v1(35.18,45.34) v1(35.55,58.29) v1(35.55,57.53) v1(35.55,56.77) v1(35.55,56.01) v1(35.56,42.93) v1(35.56,42.16) v1(35.81,52.2) v1(35.81,51.44) v1(35.81,50.67) v1(35.81,49.91) v1(35.94,47.62) v1(35.94,46.86) v1(35.94,46.1) v1(35.94,45.34) v1(36.32,42.93) v1(36.32,42.16) v1(36.7,47.62) v1(36.7,46.86) v1(36.7,46.1) v1(36.7,45.34) v1(37.08,42.93) v1(37.08,42.16) v1(41.66,48.3) v1(42.84,13.58) v1(42.84,12.83) v1(42.84,12.07) v1(42.84,11.31) v1(43.6,13.58) v1(43.6,12.83) v1(43.6,12.07) v1(43.6,11.31) v1(48.01,6.99) v1(48.01,6.22) v1(48.77,6.99) v1(48.77,6.22) v1(49.03,2.54) v1(49.03,1.78) v1(49.53,6.99) v1(49.53,6.22) v1(49.79,2.54) v1(49.79,1.78) v1(50.29,6.99) v1(50.29,6.22) v1(50.54,2.54) v1(50.54,1.78) v1(51.3,2.54) v1(51.3,1.78) v1(52.96,48.76) v1(52.96,48) v1(52.96,47.25) v1(52.96,46.49) v1(53.72,48.76) v1(53.72,48) v1(53.72,47.25) v1(53.72,46.49) v1(55.25,58.42) v1(55.25,57.66) v1(55.25,56.9) v1(55.25,56.14) v1(55.25,23.49) v1(55.25,22.73) v1(55.25,21.97) v1(55.25,21.21) v1(56.01,58.42) v1(56.01,57.66) v1(56.01,56.9) v1(56.01,56.14) v1(56.01,23.49) v1(56.01,22.73) v1(56.01,21.97) v1(56.01,21.21) v1(60.45,16.76) v1(60.45,16) v1(60.45,15.24) v1(60.45,14.48) v1(60.58,58.93) v1(60.58,58.17) v1(61.21,16.76) v1(61.21,16) v1(61.21,15.24) v1(61.21,14.48) v1(61.34,58.93) v1(61.34,58.17) v1(62.1,58.93) v1(62.1,58.17) v1(62.23,52.95) v1(62.23,52.2) v1(62.23,51.44) v1(62.23,50.68) v1(62.86,58.93) v1(62.86,58.17) v1(62.99,52.95) v1(62.99,52.2) v1(62.99,51.44) v1(62.99,50.68) v1(62.99,46.22) v1(62.99,45.46) v1(62.99,44.71) v1(62.99,43.95) v1(63.75,46.22) v1(63.75,45.46) v1(63.75,44.71) v1(63.75,43.95) v1(65.53,27.3) v1(65.53,26.54) v1(65.53,25.78) v1(65.53,25.02) v1(65.91,52.95) v1(65.91,52.2) v1(65.91,51.44) v1(65.91,50.68) v1(66.29,46.48) v1(66.29,45.72) v1(66.29,44.96) v1(66.29,44.2) v1(66.29,27.3) v1(66.29,26.54) v1(66.29,25.78) v1(66.29,25.02) v1(66.68,52.95) v1(66.68,52.2) v1(66.68,51.44) v1(66.68,50.68) v1(66.8,18.54) v1(66.8,17.78) v1(66.8,17.02) v1(66.8,16.26) v1(67.06,46.48) v1(67.06,45.72) v1(67.06,44.96) v1(67.06,44.2) v1(67.56,18.54) v1(67.56,17.78) v1(67.56,17.02) v1(67.56,16.26)
BOOT0: length 4
  Top Layer w0.254: 48.8,38.71 49.89,38.71 50.04,38.86 50.04,40 50.29,40.26 51.39,40.26 R10.2
DC: length 127.2
  Top Layer w0.381: C36.1 v1(63.48,26.92)
  Top Layer w0.508: C35.1 63.48,26.93 v1(63.48,26.92) 63.5,26.9 63.5,15.88 64.28,15.1 v1(66.93,15.1) K4.1 K3.1 ; C35.1 63.48,32.88 64.01,33.4 65.09,33.4 ; C35.1 64.9,31.37 v1(65.02,31.5) ; v1(56.26,50.04) 57,50.04 v1(58.93,48.11) ; U13.3 70.22,10.42 69.98,10.67 69.98,12.21 C41.1 71.25,12.32 v1(71.63,11.94) ; v1(52.96,50.04) v1(50.04,50.04)
  Bottom Layer w0.508: v1(65.02,31.5) 65.02,35.05 65.39,35.42 ; K4.1 69.72,15.11 71.37,15.11 71.63,14.86 v1(71.63,11.94) ; v1(56.26,50.04) v1(52.96,50.04) ; v1(58.93,48.11) 61.49,48.11 61.85,47.75 61.85,36.19 62.62,35.42 65.39,35.42 ; 65.39,35.42 K2.1 K1.1 ; DC1.4 13.63,52.62 14.1,53.09 48.64,53.09 50.04,51.69 v1(50.04,50.04)
ETH_CS: length 20.7
  Top Layer w0.254: v1(40.64,31.1) 40.64,31.5 41.83,32.68 U7.25 ; U1.59 41.68,19.95 44.58,22.79 44.58,29.46 44.07,29.97 v1(44.07,30.86)
  Bottom Layer w0.254: v1(40.64,31.1) 43.83,31.1 v1(44.07,30.86)
ETH_INT#: length 22.9
  Top Layer w0.254: U7.32 45.34,33.71 45.34,32.64 45.09,32.39 45.09,26.16 45.59,25.65 49.15,25.65 50.29,24.51 50.29,20.95 49.66,20.32 47.12,20.32 46.68,19.88 U1.49
ETH_RSTI: length 42
  Top Layer w0.254: v1(43.05,35.18) 43.31,35.18 43.83,34.66 U7.29 ; v1(48.26,33.27) 49.15,32.39 51.44,32.39 51.69,32.13 51.69,20.74 46.1,15.15 46.1,10.54 46.45,10.2 U1.36
  Bottom Layer w0.254: v1(48.26,33.27) 48.26,35.69 47.12,36.83 43.43,36.83 43.05,36.45 v1(43.05,35.18)
ETH_SCK: length 19.6
  Top Layer w0.254: U7.26 42.33,31.79 41.15,30.61 v1(41.15,29.97) ; U1.60 41.18,20.09 43.94,22.86 43.94,28.6 43.31,29.23 v1(43.31,29.97)
  Bottom Layer w0.254: v1(43.31,29.97) v1(41.15,29.97)
ETH_SDI: length 17.2
  Top Layer w0.254: 43.3,33.71 43.3,32.71 43.31,32.7 43.31,30.98 42.54,30.21 42.54,29.08 43.31,28.32 43.31,22.93 40.68,20.3 U1.61
ETH_SDO: length 17.2
  Top Layer w0.254: 42.8,33.71 42.8,31.25 41.91,30.35 41.91,28.96 42.67,28.19 42.67,22.94 40.18,20.45 U1.62
K11: length 14.9
  Top Layer w0.762: CN1.1 83.94,51.05 75.95,51.05 75.17,50.28 K1.3
K12: length 23.7
  Top Layer w0.762: K1.4 76.45,54.48 87.25,54.48 88.01,53.72 88.01,47.24 87.49,46.72 CN1.2
K21: length 18.9
  Top Layer w0.762: CN2.1 71.47,40.67 69.71,42.43 K2.3
K22: length 37.8
  Top Layer w0.762: K2.4 72.4,53.2 73.28,52.32 73.28,43.94 74.29,42.93 87.38,42.93 88.26,42.04 88.26,36.32 87.38,35.43 84.85,35.43 CN2.2
K31: length 14.9
  Top Layer w0.762: CN3.1 83.62,30.61 75.82,30.61 75.17,29.96 K3.3
K32: length 24.9
  Top Layer w0.762: K3.4 87.9,32.88 88.77,32 88.77,25.65 87.57,24.46 CN3.2
K41: length 19.4
  Top Layer w0.762: K4.3 69.71,22.62 72.01,20.32 82.78,20.32 CN4.1
K42: length 40.3
  Top Layer w0.762: K4.4 72.28,32.88 73.03,32.13 73.03,23.62 74.29,22.35 87.76,22.35 88.77,21.34 88.77,14.35 87.76,13.33 84.71,13.33 CN4.2
LINK#: length 62.6
  Top Layer w0.254: J2.10 J2.11 7.87,10.15 7.87,6.73 8.38,6.22 15.75,6.22 17.53,4.44 34.8,4.44 40.26,9.91 40.26,16.13 40.51,16.38 44.96,16.38 45.18,16.6 U1.52
M_C: length 2.7
  Top Layer w0.254: 46.3,33.71 46.3,31.05 R13.2
M_D: length 3
  Top Layer w0.254: 48.8,35.21 49.75,35.21 50.75,34.22 R12.2
M_DIR: length 45.7
  Top Layer w0.254: v1(38.74,31.75) 38.74,30.99 38.48,30.73 21.34,30.73 20.83,31.24 20.83,32.51 20.57,32.77 U11.3 17.65,32.77 17.53,32.64 17.53,31.56 17.46,31.5 ; 17.46,31.5 15.75,31.5 15.49,31.24 15.49,29.15 15.48,29.14 R16.1 ; 17.46,31.5 U11.2 ; 45.8,33.71 45.8,35.14 46.61,35.94 v1(46.74,35.94)
  Bottom Layer w0.254: v1(38.74,31.75) 40.89,31.75 41.53,32.39 45.47,32.39 45.85,32.77 45.85,35.18 46.61,35.94 v1(46.74,35.94)
M_IO_PA4: length 74.8
  Top Layer w0.254: U7.14 37.5,40.22 v1(37.21,40.51)
  Bottom Layer w0.254: H2.1 56.13,3.05 55.88,3.3 55.88,6.73 57.91,8.76 57.91,23.96 56.73,25.15 32.12,25.15 29.13,28.13 29.13,35.76 33.89,40.51 v1(37.21,40.51)
M_IO_PA5: length 81.9
  Top Layer w0.254: U7.15 36.35,39.72 v1(36.32,39.75) ; v1(59.06,16.96) 58.99,16.89 v1(57.15,16.89)
  Bottom Layer w0.254: v1(59.06,16.96) 59.06,23.54 56.94,25.65 32.26,25.65 29.59,28.32 29.59,35.57 33.77,39.75 v1(36.32,39.75) ; v1(57.15,16.89) 57.15,8.76 55.25,6.86 55.25,2.03 55.8,1.47 59.89,1.47 60.2,1.78 H2.3
M_IO_PA6: length 87
  Top Layer w0.254: v1(56.13,18.42) v1(59.82,18.42) ; U7.16 37.19,39.22 v1(36.45,38.48)
  Bottom Layer w0.254: v1(36.45,38.48) 33.15,38.48 30.05,35.38 30.05,28.63 32.51,26.16 57.15,26.16 59.82,23.5 v1(59.82,18.42) ; v1(56.13,18.42) 56.13,8.51 54.61,6.99 54.61,1.65 55.25,1.02 62.48,1.02 62.74,1.27 H2.5
M_IO_PA7: length 92.9
  Top Layer w0.254: U7.17 37.83,38.72 v1(37.34,38.23) ; v1(55.25,19.56) v1(60.96,19.56)
  Bottom Layer w0.254: v1(55.25,19.56) 55.25,17.53 55.68,17.09 55.68,10.21 53.85,8.38 53.85,1.4 54.74,0.51 65.02,0.51 65.28,0.76 H2.7 ; v1(37.34,38.23) 36.58,37.47 32.86,37.47 30.51,35.11 30.51,28.92 32.75,26.67 57.36,26.67 60.96,23.07 v1(60.96,19.56)
M_IO_PB1: length 76.4
  Top Layer w0.254: U7.19 v1(41.91,37.72)
  Bottom Layer w0.254: v1(41.91,37.72) 40.39,37.72 39.64,36.97 39.64,36.95 39.5,36.81 39.5,35.94 38.74,35.18 33.26,35.18 32.38,34.3 32.38,29.84 33.53,28.7 58.2,28.7 65.02,21.88 65.02,8.25 64.52,7.75 58.29,7.75 57.66,7.11 H2.2
M_IO_PB2: length 70.5
  Top Layer w0.254: v1(60.2,8.51) H2.4 ; U7.20 v1(38.99,37.22)
  Bottom Layer w0.254: v1(38.99,37.22) 38.99,36.3 38.38,35.69 33.02,35.69 31.88,34.54 31.88,29.59 33.27,28.19 57.99,28.19 64.13,22.05 64.13,9.02 63.63,8.51 v1(60.2,8.51)
M_IO_PB10: length 71
  Top Layer w0.254: U7.21 v1(41.91,36.72)
  Bottom Layer w0.254: v1(41.91,36.72) 40.41,36.72 39.95,36.27 39.95,35.64 38.86,34.54 33.27,34.54 32.84,34.11 32.84,30.03 33.67,29.21 58.41,29.21 65.66,21.96 65.66,7.75 65.02,7.11 63.12,7.11 62.74,6.73 H2.6
M_IO_PB11: length 68.5
  Top Layer w0.254: v1(38.23,36.45) 38.74,36.45 38.96,36.22 U7.22 ; H2.8 65.28,7.11 65.02,7.37 63.37,7.37 63.12,7.62 v1(63.12,9.27)
  Bottom Layer w0.254: v1(63.12,9.27) 63.37,9.53 63.37,22.09 57.78,27.69 33.06,27.69 31.42,29.33 31.42,34.73 33.14,36.45 v1(38.23,36.45)
M_K1: length 22.3
  Top Layer w0.254: 57.69,41.02 U9.2 ; 57.69,41.02 v1(55.88,41.02) ; 57.69,41.02 57.69,41.94 58.04,42.29 U9.1 ; v1(44.32,39.88) 43.31,39.88 42.83,40.36 U7.10
  Bottom Layer w0.254: v1(44.32,39.88) 52.58,39.88 53.72,41.02 v1(55.88,41.02)
M_K2: length 24.3
  Top Layer w0.254: U7.11 42.33,39.59 42.93,38.99 v1(43.81,38.99) ; U9.3 57.91,39.75 57.66,39.5 57.66,38.54 57.6,38.48 ; 57.6,38.48 59.62,38.48 ; 57.6,38.48 v1(56.64,38.48)
  Bottom Layer w0.254: v1(43.81,38.99) 48.69,38.99 50.21,37.47 55.5,37.47 56.51,38.48 v1(56.64,38.48)
M_K3: length 25.8
  Top Layer w0.254: 57.78,35.94 U9.6 ; 57.78,35.94 57.78,36.83 58.04,37.08 59.49,37.08 U9.5 ; 57.78,35.94 v1(55.88,35.94) ; v1(44.45,38.23) 42.54,38.23 41.83,38.94 U7.12
  Bottom Layer w0.254: v1(55.88,35.94) 55.12,35.18 50.5,35.18 47.46,38.23 v1(44.45,38.23)
M_K4: length 27.2
  Top Layer w0.254: U7.13 38.53,40.72 v1(37.97,41.28) ; U9.7 v1(55.75,34.67)
  Bottom Layer w0.254: v1(37.97,41.28) 38.48,40.77 40.64,40.77 44.07,37.34 44.83,37.34 45.09,37.59 47.24,37.59 50.16,34.67 v1(55.75,34.67)
M_KC1: length 15
  Top Layer w0.381: K1.2 73.5,39.62 70.99,39.62 68.33,42.29 67.14,42.29 ; U9.15 66.8,41.02 67.18,41.4 67.18,42.24 67.14,42.29 ; 67.14,42.29 U9.16
M_KC2: length 9
  Top Layer w0.381: U9.14 66.94,39.75 ; 66.94,39.75 69.22,39.75 69.72,39.24 69.72,37.98 K2.2 ; 66.94,39.75 66.94,38.88 66.55,38.48 65.09,38.48
M_KC3: length 29.7
  Top Layer w0.381: U9.12 66.88,37.21 ; 66.88,37.21 66.93,37.16 66.93,36.19 66.68,35.94 U9.11 ; 66.88,37.21 67.82,37.21 68.2,36.83 68.2,22.22 72.78,17.64 K3.2
M_KC4: length 20.1
  Top Layer w0.381: U9.10 67.06,34.67 67.31,34.42 67.31,20.04 K4.2
M_RST#: length 9.1
  Top Layer w0.254: 44.3,42.21 44.3,43.2 42.93,44.58 41.53,44.58 40.13,45.97 40.13,46.81 C28.1 38.28,46.82 R11.1
M_RXD: length 36.8
  Top Layer w0.254: v1(39.75,32.64) 39.75,30.48 39.5,30.23 U11.1 17.65,30.23 17.29,29.86 R18.2 ; v1(44.68,36.07) 44.83,35.92 U7.31
  Bottom Layer w0.254: v1(44.68,36.07) 44.78,35.96 44.78,33.72 44.08,33.02 40.13,33.02 v1(39.75,32.64)
M_SCL: length 49.3
  Top Layer w0.254: U10.6 47.5,56.39 47.27,56.62 OLED1.3 ; 48.8,37.71 49.79,37.71 50.16,37.34 50.16,36.43 v1(50.28,36.32) 51.42,36.32 R15.2
  Bottom Layer w0.254: v1(50.28,36.32) 53.09,36.32 53.59,36.83 56.26,36.83 57.4,37.97 57.4,42.55 55.76,44.2 52.71,44.2 52.01,44.9 52.01,58.73 51.56,59.18 47.62,59.18 47.27,58.83 OLED1.3
M_SDA: length 36.4
  Top Layer w0.254: 48.8,38.21 v1(50.38,38.21) 51.33,38.21 R14.1 ; OLED1.4 50.15,57.66 U10.5
  Bottom Layer w0.254: OLED1.4 49.85,58.04 50.93,58.04 51.38,57.59 51.38,44.64 52.45,43.56 55.5,43.56 56.77,42.29 56.77,39.88 56.26,39.37 53.72,39.37 52.56,38.21 v1(50.38,38.21)
M_TXD: length 36.1
  Top Layer w0.254: v1(37.72,32.64) 37.72,31.62 37.47,31.37 21.72,31.37 21.34,31.75 21.34,33.53 20.83,34.04 U11.4 18.03,34.04 17.8,34.27 R17.1 ; v1(43.94,35.56) 44.3,35.2 44.3,33.71
  Bottom Layer w0.254: v1(37.72,32.64) 38.61,33.53 43.94,33.53 44.32,33.91 44.32,35.18 v1(43.94,35.56)
M_X1: length 8.4
  Top Layer w0.254: 45.3,42.21 45.3,44.92 46.3,45.92 C33.2 46.3,47.57 47.39,48.66 U8.2
M_X2: length 8.1
  Top Layer w0.254: U8.1 43.29,48.4 44.16,47.54 C34.2 44.16,45.76 44.8,45.11 44.8,42.21
RXN: length 25.4
  Top Layer w0.254: J2.6 19.91,14.08 R3.1 22.86,15.59 23.04,15.77 24.42,15.77 26.86,18.21 27.54,18.21 27.72,18.03 27.72,17.58 27.9,17.4 28.56,17.4 28.74,17.58 28.74,18.03 28.92,18.21 29.57,18.21 29.75,18.03 29.75,17.58 29.93,17.4 30.59,17.4 30.77,17.58 30.77,18.03 30.95,18.21 33.47,18.21 34.31,17.37 34.31,14.89 34.99,14.22 35.9,14.22 35.92,14.2 U1.5
RXP: length 25.5
  Top Layer w0.254: J2.3 17.37,17.92 R5.1 22.86,16.44 23.04,16.26 24.26,16.26 26.67,18.67 33.66,18.67 34.77,17.55 34.77,15.08 35.18,14.67 35.9,14.67 35.92,14.7 U1.4
S_CTRL: length 42.1
  Top Layer w0.254: 48.8,35.71 47.67,35.71 47.52,35.56 47.52,35.03 49.4,33.15 51.94,33.15 52.45,32.64 52.45,20.95 56.39,17.02 56.39,13.08 56.77,12.7 62.61,12.7 64.87,10.44 R23.2 66.72,10.42 U13.4
SEN_OUT: length 91.9
  Top Layer w0.254: v1(62.36,13.72) 71.25,13.72 72.29,12.68 C39.1 78.76,12.68 79.38,12.06 79.38,10.54 80.01,9.91 84.58,9.91 85.47,9.02 85.47,5.33 83.79,3.66 U12.4 ; U7.18 40.29,38.19 39.04,38.19 38.56,37.72 v1(38.1,37.72)
  Bottom Layer w0.254: v1(62.36,13.72) 62.36,22.39 57.57,27.18 32.89,27.18 30.96,29.11 30.96,34.92 33,36.96 37.34,36.96 v1(38.1,37.72)
TXN: length 34.3
  Top Layer w0.254: J2.2 19.89,20.76 21.65,22.51 23.3,22.51 23.97,21.84 R8.1 25.85,21.84 26.52,22.51 27.69,22.51 27.87,22.33 27.87,20.38 28.51,19.74 29,19.74 29.18,19.56 29.18,19.36 29.35,19.18 30.01,19.18 30.19,19.36 30.19,19.56 30.37,19.74 31.03,19.74 31.21,19.56 31.21,19.36 31.39,19.18 32.04,19.18 32.22,19.36 32.22,19.56 32.4,19.74 35.12,19.74 35.87,18.99 35.87,17.83 v1(35.56,17.53) ; v1(39.24,12.43) 38.98,12.7 U1.8
  Bottom Layer w0.254: v1(35.56,17.53) 35.84,17.25 35.84,14.03 37.16,12.72 38.96,12.72 v1(39.24,12.43)
TXP: length 34.1
  Top Layer w0.254: U1.7 38.98,13.2 v1(39.24,13.46) ; v1(36.58,17.4) 36.32,17.65 36.32,19.18 35.31,20.19 28.7,20.19 28.32,20.57 28.32,22.52 27.86,22.99 26.5,22.99 25.85,23.64 R9.1 23.97,23.64 23.3,22.97 21.46,22.97 18.94,20.45 J2.1
  Bottom Layer w0.254: v1(36.58,17.4) 36.3,17.12 36.3,14.25 37.37,13.17 38.96,13.17 v1(39.24,13.46)
V_HU: length 10.7
  Top Layer w0.508: U13.1 74.7,8.52 C40.2 79.76,8.51 80.24,8.03 U12.1
XI: length 10.8
  Top Layer w0.254: U1.10 31.68,11.7 30.92,12.46 C16.2 27.94,12.46 X1.2
XO: length 10.9
  Top Layer w0.254: X1.1 28.21,10.41 C17.2 30.9,10.41 31.68,11.2 U1.11
$1N6890: length 8.9
  Top Layer w0.254: R4.1 34.54,21.08 34.8,20.83 35.56,20.83 38.35,18.03 38.35,16.76 38.48,16.64 38.48,16.38 38.29,16.2 U1.1
$1N7627: length 6.3
  Top Layer w0.254: U1.58 42.18,19.7 44.45,21.97 45.91,21.97 R1.1
$1N10654: length 4
  Top Layer w0.254: J2.8 19.89,10.71 20.34,10.27 R2.1
$1N10919: length 2.8
  Top Layer w0.254: R7.1 6.11,6.63 J2.12
$1N10952: length 2.7
  Top Layer w0.254: J2.9 6.11,25.25 R6.1
$2N5291: length 58.6
  Top Layer w0.254: R12.1 v1(53.4,32)
  Bottom Layer w0.254: v1(53.4,32) 56.39,32 58.04,33.66 58.04,43.05 56.51,44.58 56.51,48.51 60.07,52.07 60.07,56.13 60.71,56.77 73.03,56.77 73.41,57.15 73.41,58.93 73.91,59.44 82.68,59.44 82.93,59.18 H1.1
$2N5344: length 60.1
  Top Layer w0.254: R13.1 46.31,27.56 46.56,27.31 50.67,27.31 50.93,27.56 v1(50.93,31.5)
  Bottom Layer w0.254: v1(50.93,31.5) 51.31,31.11 56.51,31.11 58.67,33.27 58.67,43.49 57.15,45.02 57.15,48.25 60.71,51.81 60.71,55.87 60.97,56.13 74.93,56.13 75.31,56.52 H1.4
$2N14954: length 11
  Top Layer w0.254: U11.7 11.67,31.5 R21.1 R20.2 5.39,29.07 CN5.2
$2N14989: length 10.9
  Top Layer w0.254: U11.6 11.41,32.77 R21.2 R19.1 5.4,34.94 CN5.1

## Copper pours and planes (outline as drawn; the poured copper is in the pictures)
1V8 on Top Layer: 21.72,52.07 21.46,52.32 21.46,53.34 21.72,53.59 26.67,53.59 26.92,53.85 26.92,54.74 27.28,55.09 30,55.09 30.23,54.86 30.23,43.18 29.97,42.93 29.97,42.16 29.72,41.91 27.69,41.91 27.43,42.16 27.43,46.57 27.29,46.71 27.29,51.58 26.8,52.07
3V3 on Top Layer: 17.14,58.93 18.54,58.93 18.67,58.8 18.67,53.34 19.05,52.96 19.94,52.96 20.32,52.58 20.32,51.56 20.57,51.31 24.26,51.31 24.64,50.93 24.64,49.42 24.54,49.32 22.01,49.32 21.84,49.15 21.84,45.97 22.1,45.72 22.1,42.8 21.84,42.55 18.03,42.55 17.78,42.8 17.78,47.22 17.53,47.47 17.53,49.53 17.15,49.9 15.76,49.9 15.49,50.17 15.49,53.34 16,53.85 16.76,53.85 17.14,54.23
GND on Top Layer: -4.19,67.18 93.73,67.18 93.73,-3.05 -4.19,-3.05
GND on Top Layer: 13.59,56.9 4.73,56.9 4.51,57.12 4.51,59.25 4.7,59.44 13.59,59.44
GND on Bottom Layer: -6.22,67.82 94.11,67.82 94.11,-5.84 -6.22,-5.84
PGND on Bottom Layer: 12.57,25.65 15.24,25.65 15.75,25.15 15.75,4.57 16.76,3.56 16.76,-1.65 16.13,-2.29 12.19,-2.29 11.05,-1.14 11.05,24.13
DC on Top Layer: 14.35,55.25 14.35,47.24 14.1,46.99 9.53,46.99 8.89,47.62 8.89,56.66 14.24,56.66 14.86,57.28 14.86,58.8 14.99,58.93 16.26,58.93 16.38,58.8 16.38,55.5 16.13,55.25
